# EAGLE design irisc (EAGLE 9.2.2)

## Sheet 1 of 6
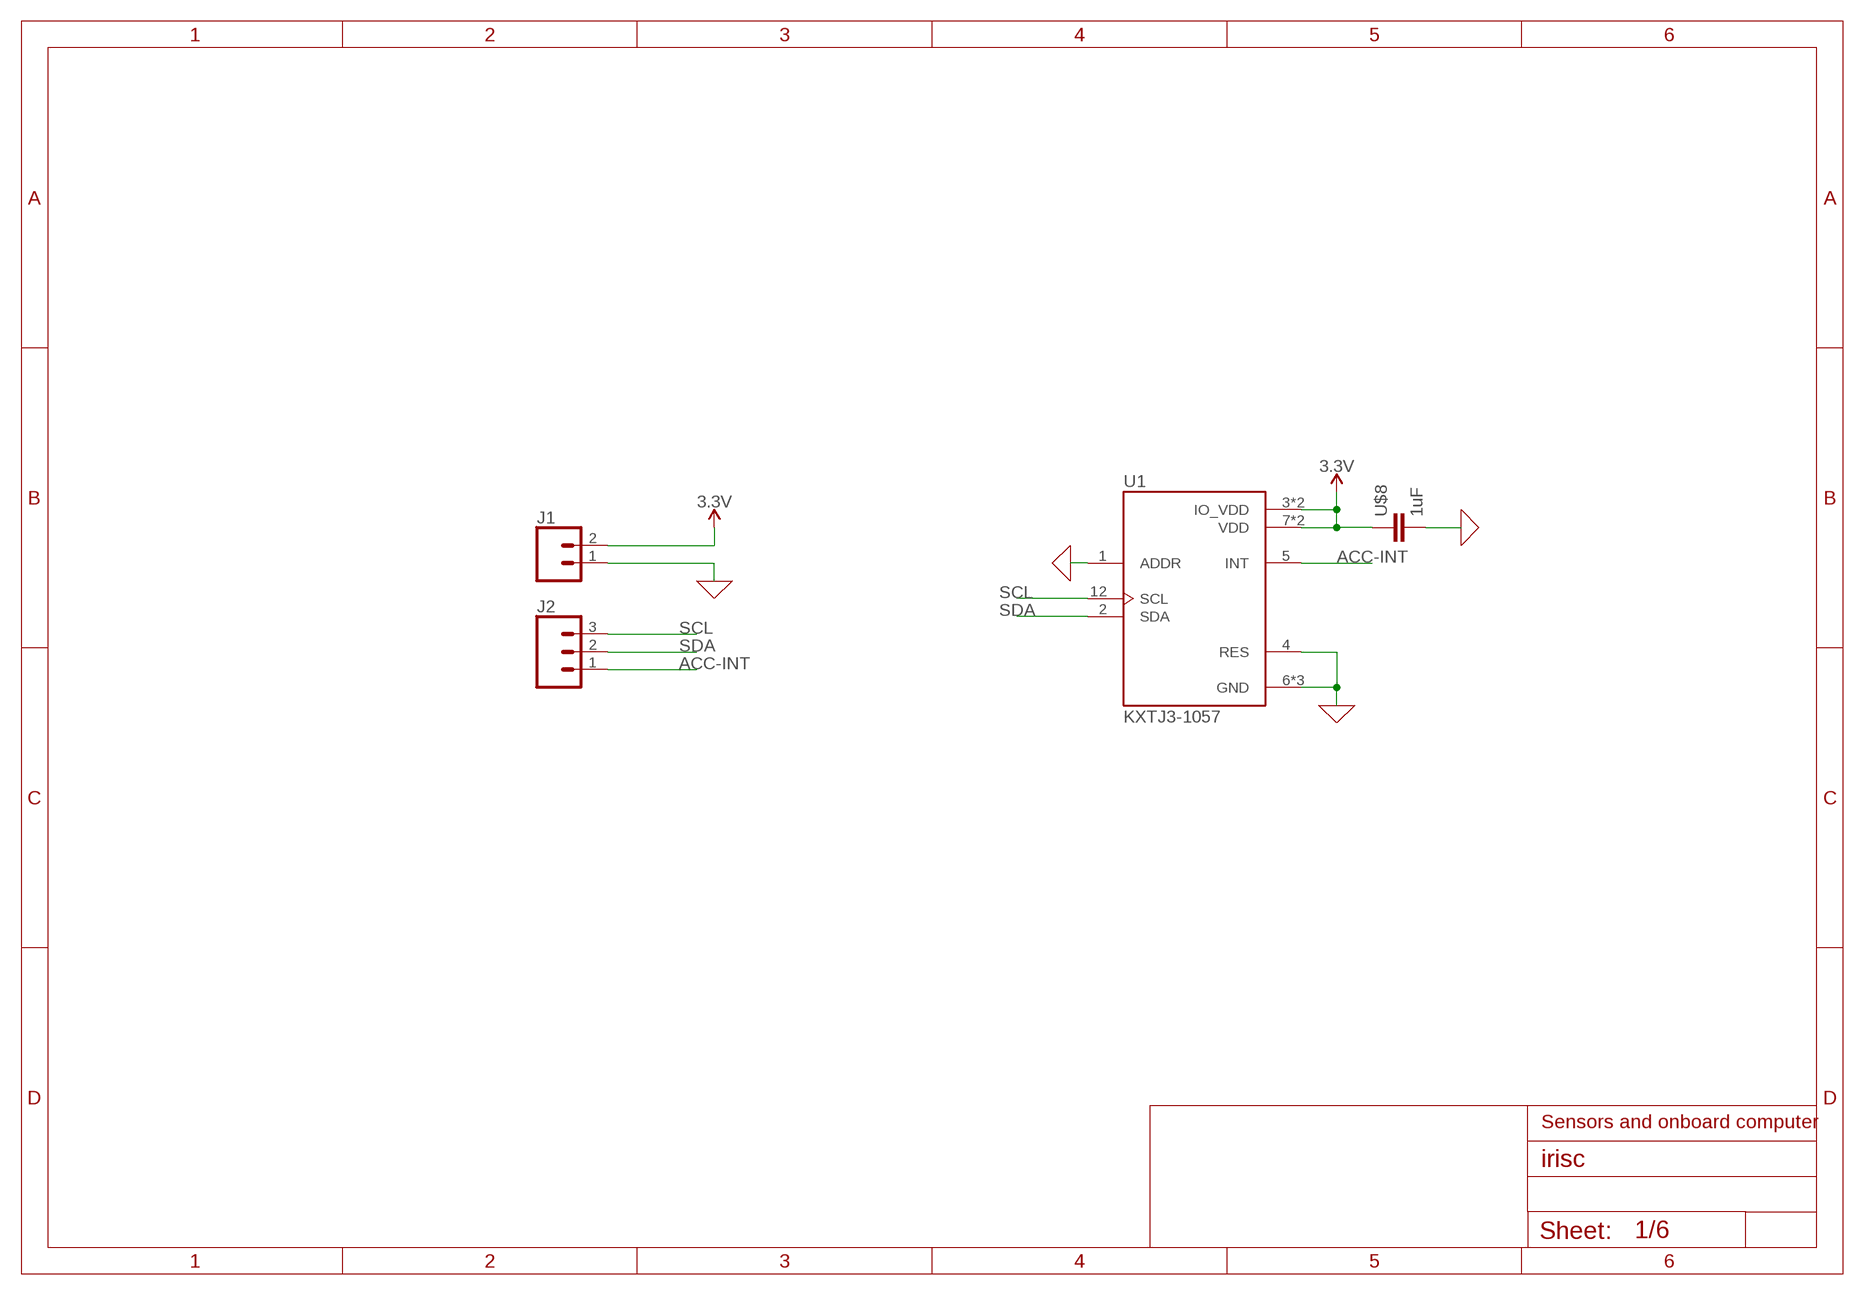
[diagram p0: schematic, sheet 1]

### Parts
J1  CONN_02  [1X02]
J2  CONN_03  [1X03]
U1  KXTJ3-1057  [KIONIX_KXTJ3-1057]
U$8  1uF  CAPACITOR_0603_N  [RESC0603_N]

### Nets
0: J1.1 U1.1(ADDR) U1.4(RES) U1.6(GND) U1.8(GND) U1.9(GND) U$8.2 ; supply symbol labelled GND ; also sheet 2,3,4,5,6
3.3V: J1.2 U1.3(IO_VDD) U1.7(VDD) U1.10(VDD) U1.11(IO_VDD) U$8.1 ; also sheet 2,3,5
ACC-INT: J2.1 U1.5(INT)
SCL: J2.3 U1.12(SCL) ; also sheet 2,5,6
SDA: J2.2 U1.2(SDA) ; also sheet 2,5,6

### Notes on the sheet
- Sensors and onboard computer

## Sheet 2 of 6
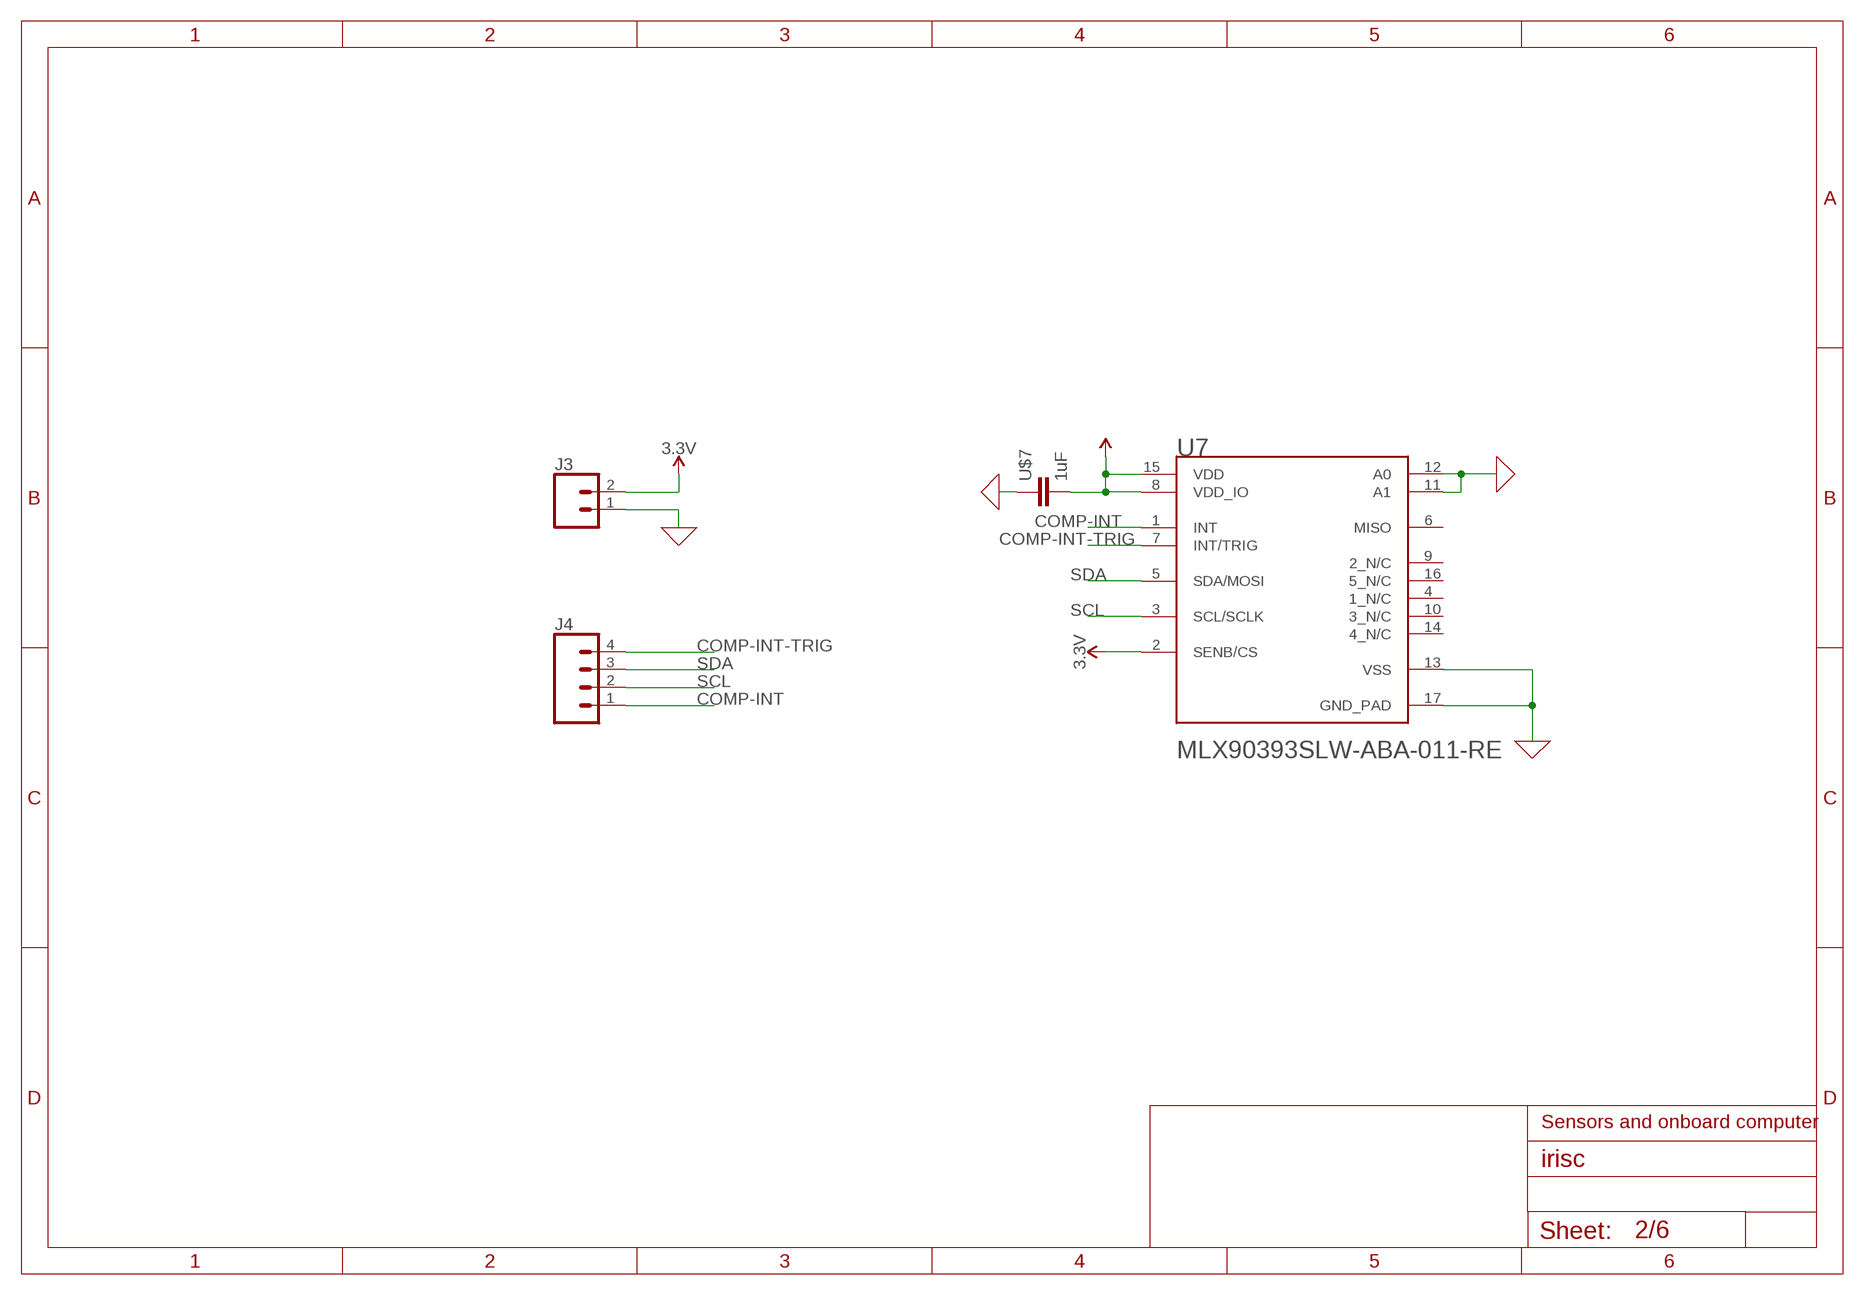
[diagram p1: schematic, sheet 2]

### Parts
J3  CONN_02  [1X02]
J4  CONN_04  [1X04]
U7  MELEXIS_TECHNOLOGIES_MLX90393SLW-ABA-011-REMELEXIS_TECHNOLOGIES_MLX90393SLW-ABA-011-RE_0_0  [MELEXIS_TECHNOLOGIES_MLX90393SLW-ABA-011-RE_0]
U$7  1uF  CAPACITOR_0603_N  [RESC0603_N]

### Nets
0: J3.1 U7.11(A1) U7.12(A0) U7.13(VSS) U7.17(GND_PAD) U$7.1 ; supply symbol labelled GND ; also sheet 1,3,4,5,6
3.3V: J3.2 U7.2(SENB/CS) U7.8(VDD_IO) U7.15(VDD) U$7.2 ; also sheet 1,3,5
COMP-INT: J4.1 U7.1(INT)
COMP-INT-TRIG: J4.4 U7.7(INT/TRIG)
SCL: J4.2 U7.3(SCL/SCLK) ; also sheet 1,5,6
SDA: J4.3 U7.5(SDA/MOSI) ; also sheet 1,5,6
Unconnected: U7.4(1_N/C) U7.6(MISO) U7.9(2_N/C) U7.10(3_N/C) U7.14(4_N/C) U7.16(5_N/C)

### Notes on the sheet
- Sensors and onboard computer

## Sheet 3 of 6
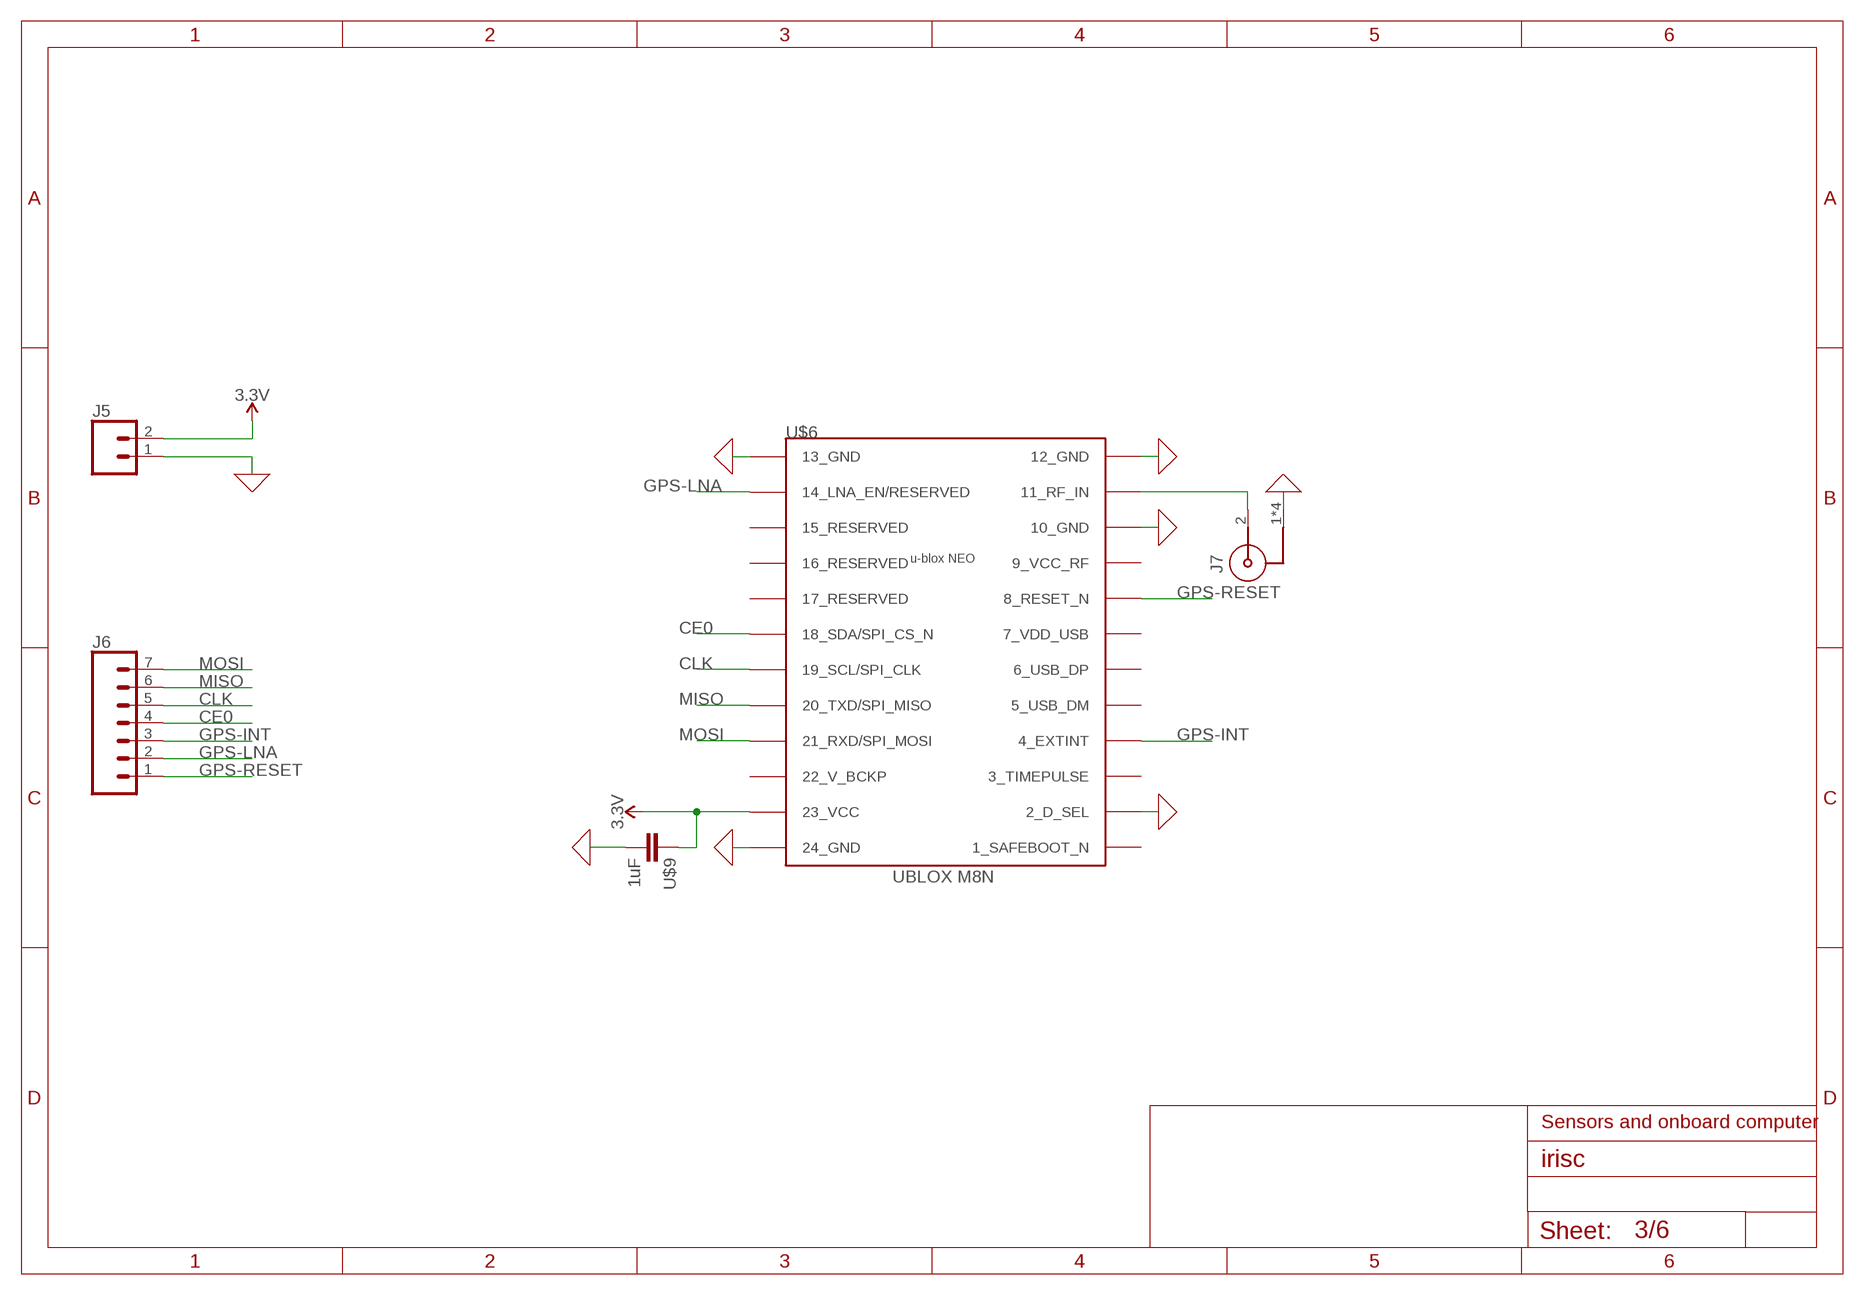
[diagram p2: schematic, sheet 3]

### Parts
J5  CONN_02  [1X02]
J6  CONN_07  [1X07]
J7  60312202114508  [60312202114508]
U$6  NEO-M8  [NEO-M8]
U$9  1uF  CAPACITOR_0603_N  [RESC0603_N]

### Nets
0: J5.1 J7.1 J7.3 J7.4 J7.5 U$6.2(2_D_SEL) U$6.10(10_GND) U$6.12(12_GND) U$6.13(13_GND) U$6.24(24_GND) U$9.2 ; supply symbol labelled GND ; also sheet 1,2,4,5,6
3.3V: J5.2 U$6.23(23_VCC) U$9.1 ; also sheet 1,2,5
CE0: J6.4 U$6.18(18_SDA/SPI_CS_N)
CLK: J6.5 U$6.19(19_SCL/SPI_CLK) ; also sheet 4
GPS-INT: J6.3 U$6.4(4_EXTINT)
GPS-LNA: J6.2 U$6.14(14_LNA_EN/RESERVED)
GPS-RESET: J6.1 U$6.8(8_RESET_N)
MISO: J6.6 U$6.20(20_TXD/SPI_MISO) ; also sheet 4
MOSI: J6.7 U$6.21(21_RXD/SPI_MOSI) ; also sheet 4
N$39: J7.2 U$6.11(11_RF_IN)
Unconnected: U$6.1(1_SAFEBOOT_N) U$6.3(3_TIMEPULSE) U$6.5(5_USB_DM) U$6.6(6_USB_DP) U$6.7(7_VDD_USB) U$6.9(9_VCC_RF) U$6.15(15_RESERVED) U$6.16(16_RESERVED) U$6.17(17_RESERVED) U$6.22(22_V_BCKP)

### Notes on the sheet
- Sensors and onboard computer

## Sheet 4 of 6
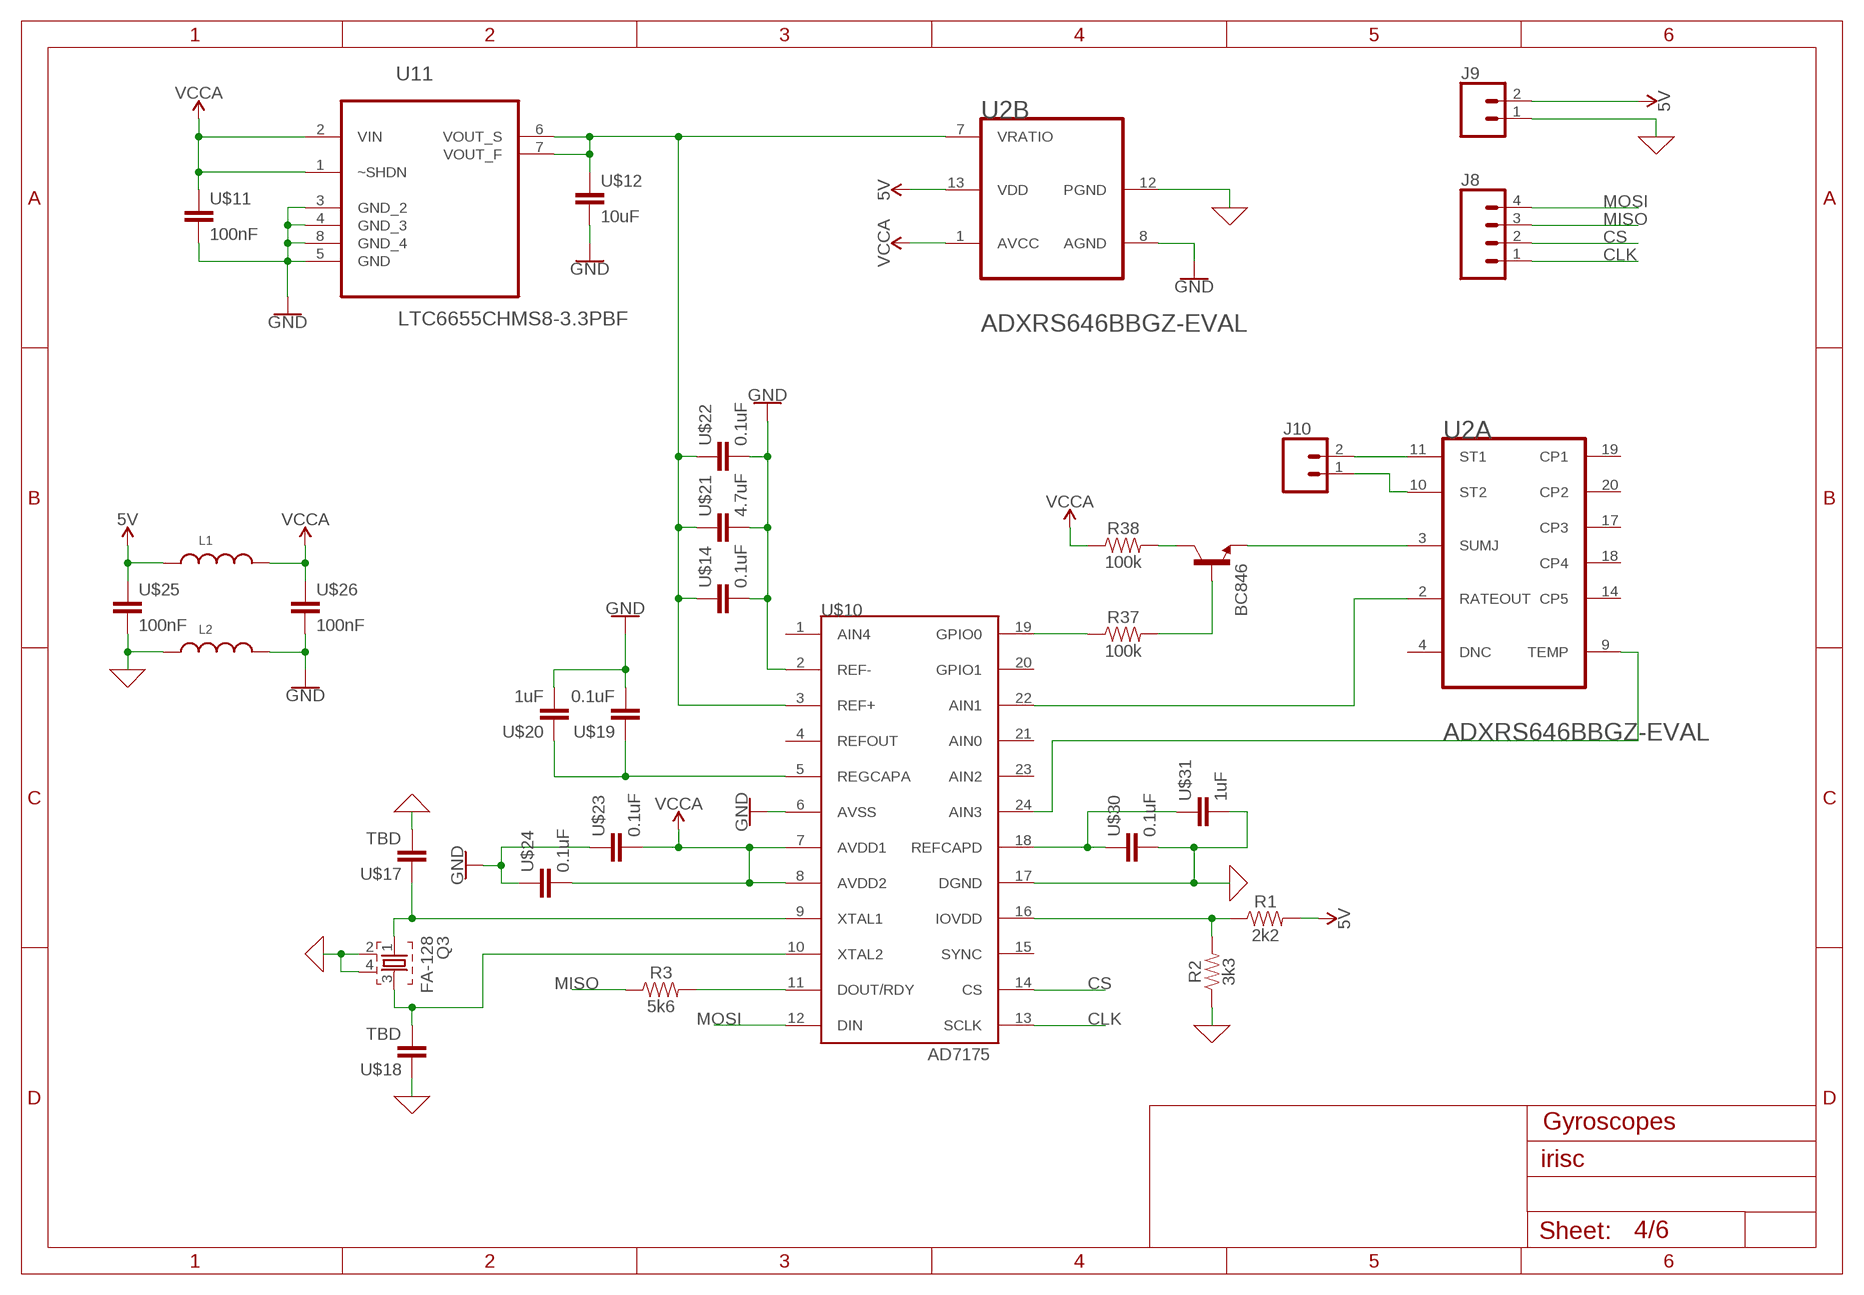
[diagram p3: schematic, sheet 4]

### Parts
J8  CONN_04  [1X04]
J9  CONN_02  [1X02]
J10  CONN_02  [1X02]
L1  WE-CBA_0805_782853152_HC  [WE-CBA_0805(W=4)]
L2  WE-CBA_0805_782853152_HC  [WE-CBA_0805(W=4)]
Q3  FA-128  [FA-128]
R1  2k2  100KOHM-HORIZ_KIT-1/4W-1%  [AXIAL-0.3-KIT]
R2  3k3  100KOHM-HORIZ_KIT-1/4W-1%  [AXIAL-0.3-KIT]
R3  5k6  100KOHM-HORIZ_KIT-1/4W-1%  [AXIAL-0.3-KIT]
R37  100k  100KOHM-HORIZ_KIT-1/4W-1%  [AXIAL-0.3-KIT]
R38  100k  100KOHM-HORIZ_KIT-1/4W-1%  [AXIAL-0.3-KIT]
T1  BC846  [SOT23]
U2  ANALOG_DEVICES_ADXRS646BBGZEVAL  [HDRVR20W64P762X254_2X10_2540X1016X254B]
U11  LTC6655CHMS8-3.3PBF  [SOP65P490X110-8N]
U$10  AD7175  [TSSOP24]
U$11  100nF  CAPACITOR_0603_N  [RESC0603_N]
U$12  10uF  CAPACITOR_0805_L  [RESC0805_L]
U$14  0.1uF  CAPACITOR_0603_N  [RESC0603_N]
U$17  TBD  CAPACITOR_0805_L  [RESC0805_L]
U$18  TBD  CAPACITOR_0805_L  [RESC0805_L]
U$19  0.1uF  CAPACITOR_0603_N  [RESC0603_N]
U$20  1uF  CAPACITOR_0603_N  [RESC0603_N]
U$21  4.7uF  CAPACITOR_0603_N  [RESC0603_N]
U$22  0.1uF  CAPACITOR_0603_N  [RESC0603_N]
U$23  0.1uF  CAPACITOR_0603_N  [RESC0603_N]
U$24  0.1uF  CAPACITOR_0603_N  [RESC0603_N]
U$25  100nF  CAPACITOR_0603_N  [RESC0603_N]
U$26  100nF  CAPACITOR_0603_N  [RESC0603_N]
U$30  0.1uF  CAPACITOR_0603_N  [RESC0603_N]
U$31  1uF  CAPACITOR_0603_N  [RESC0603_N]

### Nets
0: J9.1 L2.1 Q3.2 Q3.4 R2.P$1 U2.12(B:PGND) U$10.17(DGND) U$17.2 U$18.1 U$25.2 U$30.2 U$31.2 ; supply symbol labelled GND ; also sheet 1,2,3,5,6
5V: J9.2 L1.1 R1.P$2 U2.13(B:VDD) U$25.1 ; also sheet 6
CLK: J8.1 U$10.13(SCLK) ; also sheet 3
CS: J8.2 U$10.14(CS)
GND: L2.2 U2.8(B:AGND) U11.3(GND_2) U11.4(GND_3) U11.5(GND) U11.8(GND_4) U$10.2(REF-) U$10.6(AVSS) U$11.2 U$12.2 U$14.2 U$19.2 U$20.2 U$21.2 U$22.2 U$23.1 U$24.1 U$26.2
MISO: J8.3 R3.P$1 ; also sheet 3
MOSI: J8.4 U$10.12(DIN) ; also sheet 3
N$1: J10.1 U2.10(A:ST2)
N$2: Q3.3 U$10.10(XTAL2) U$18.2
N$40: Q3.1 U$10.9(XTAL1) U$17.1
N$42: J10.2 U2.11(A:ST1)
N$43: R38.P$2 T1.3(C)
N$45: U$10.5(REGCAPA) U$19.1 U$20.1
N$46: R37.P$2 T1.1(B)
N$48: U2.7(B:VRATIO) U11.6(VOUT_S) U11.7(VOUT_F) U$10.3(REF+) U$12.1 U$14.1 U$21.1 U$22.1
N$50: R1.P$1 R2.P$2 U$10.16(IOVDD)
N$51: U$10.18(REFCAPD) U$30.1 U$31.1
N$53: T1.2(E) U2.3(A:SUMJ)
N$58: U2.2(A:RATEOUT) U$10.22(AIN1)
N$59: U2.9(A:TEMP) U$10.24(AIN3)
N$66: R37.P$1 U$10.19(GPIO0)
SDF: R3.P$2 U$10.11(DOUT/RDY)
VCCA: L1.2 R38.P$1 U2.1(B:AVCC) U11.1(~SHDN) U11.2(VIN) U$10.7(AVDD1) U$10.8(AVDD2) U$11.1 U$23.2 U$24.2 U$26.1
Unconnected: U2.4(A:DNC) U2.17(A:CP3) U2.18(A:CP4) U2.19(A:CP1) U2.20(A:CP2) U$10.1(AIN4) U$10.4(REFOUT) U$10.15(SYNC) U$10.20(GPIO1) U$10.21(AIN0) U$10.23(AIN2)

### Notes on the sheet
- Gyroscopes

## Sheet 5 of 6
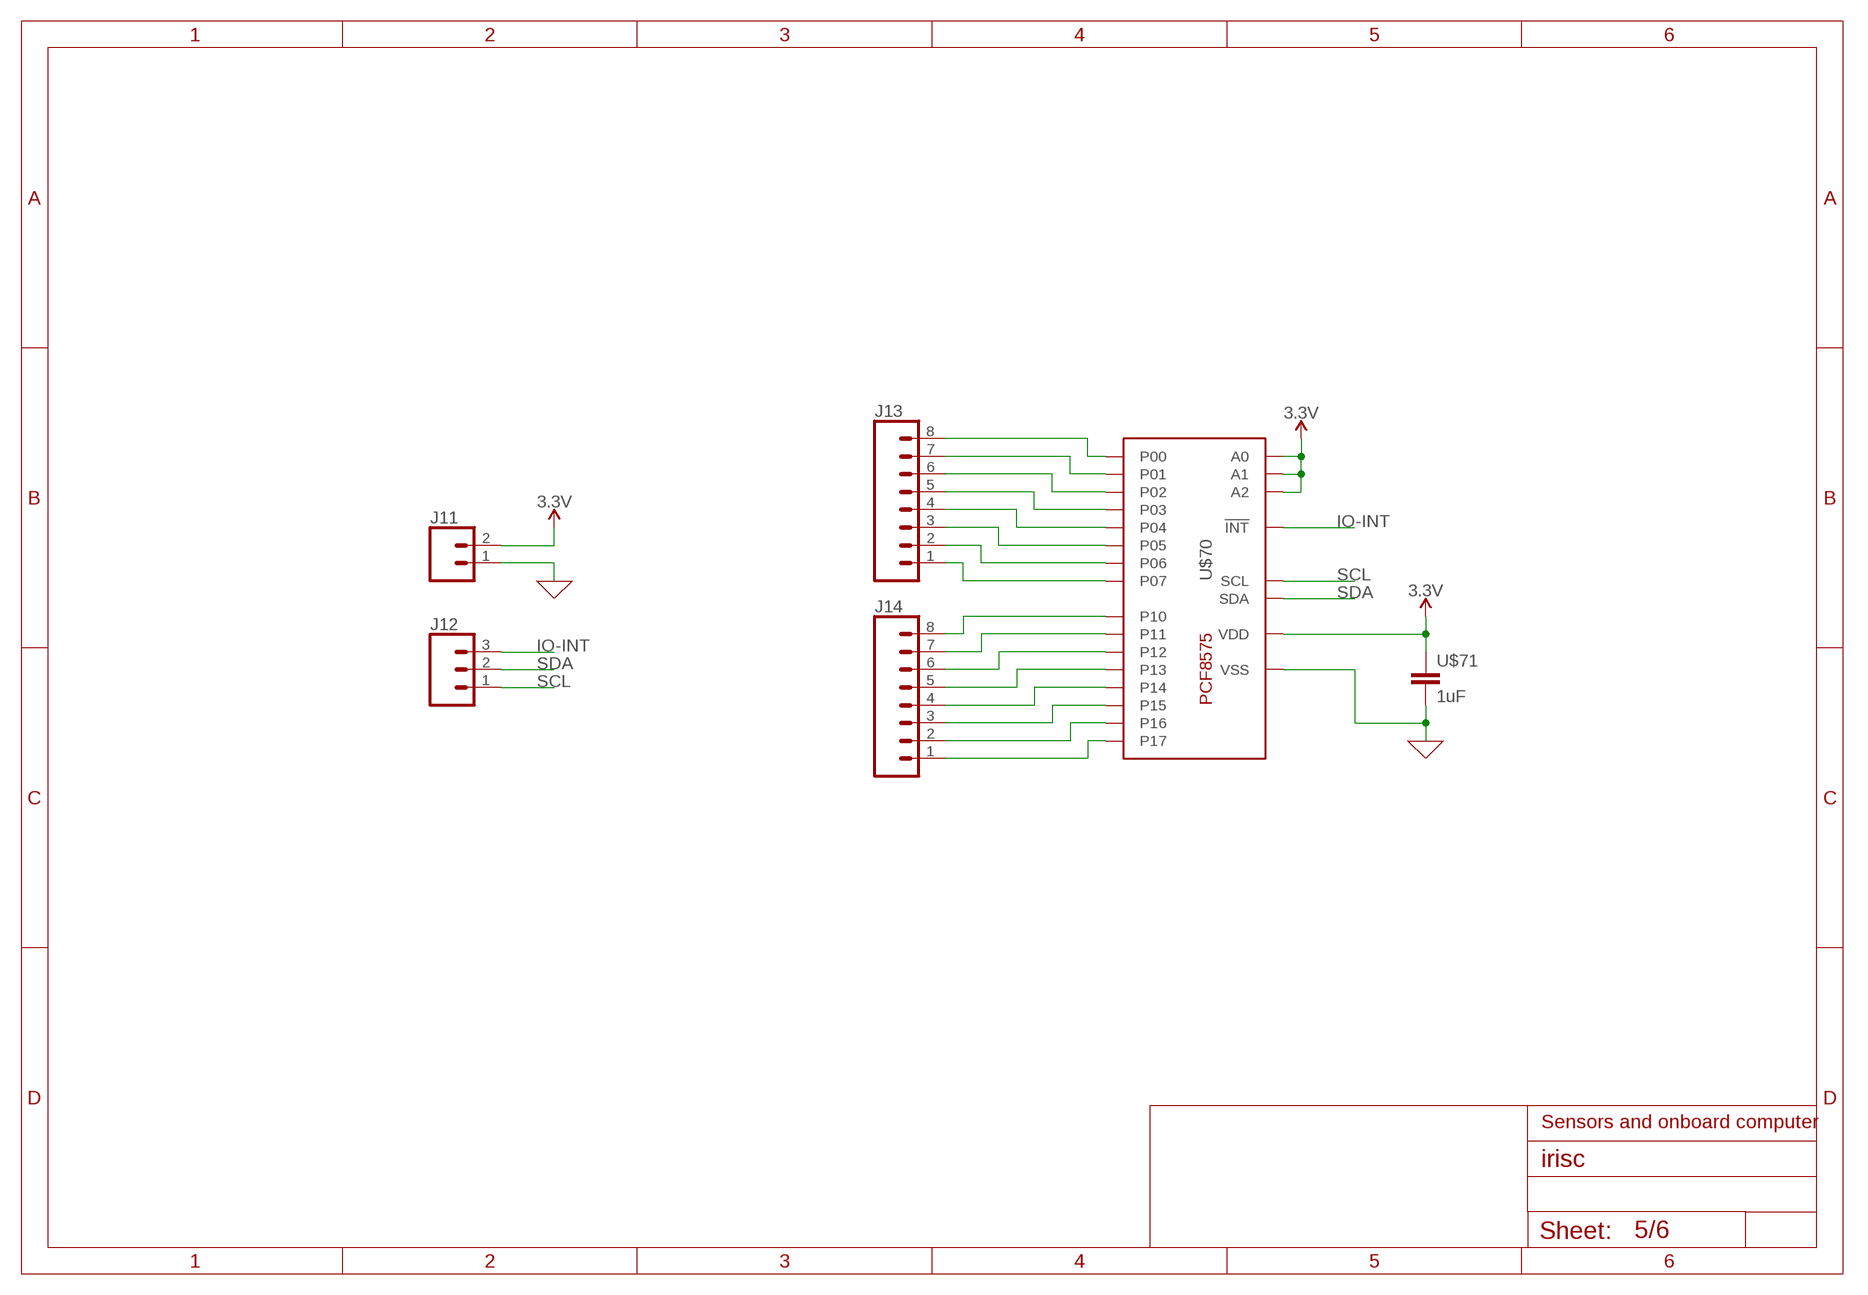
[diagram p4: schematic, sheet 5]

### Parts
J11  CONN_02  [1X02]
J12  CONN_03  [1X03]
J13  CONN_08"  [1X08]
J14  CONN_08"  [1X08]
U$70  PCF8575CSSOP24N  [SOP65P810X120-24]
U$71  1uF  CAPACITOR_0603_N  [RESC0603_N]

### Nets
0: J11.1 U$70.12(VSS) U$71.2 ; supply symbol labelled GND ; also sheet 1,2,3,4,6
3.3V: J11.2 U$70.2(A1) U$70.3(A2) U$70.21(A0) U$70.24(VDD) U$71.1 ; also sheet 1,2,3
IO-INT: J12.3 U$70.1(!INT)
N$3: J13.8 U$70.4(P00)
N$4: J13.7 U$70.5(P01)
N$5: J13.6 U$70.6(P02)
N$6: J13.5 U$70.7(P03)
N$7: J13.4 U$70.8(P04)
N$8: J13.3 U$70.9(P05)
N$9: J13.2 U$70.10(P06)
N$10: J13.1 U$70.11(P07)
N$11: J14.8 U$70.13(P10)
N$12: J14.7 U$70.14(P11)
N$13: J14.6 U$70.15(P12)
N$14: J14.5 U$70.16(P13)
N$15: J14.4 U$70.17(P14)
N$16: J14.3 U$70.18(P15)
N$17: J14.2 U$70.19(P16)
N$18: J14.1 U$70.20(P17)
SCL: J12.1 U$70.22(SCL) ; also sheet 1,2,6
SDA: J12.2 U$70.23(SDA) ; also sheet 1,2,6

### Notes on the sheet
- Sensors and onboard computer

## Sheet 6 of 6
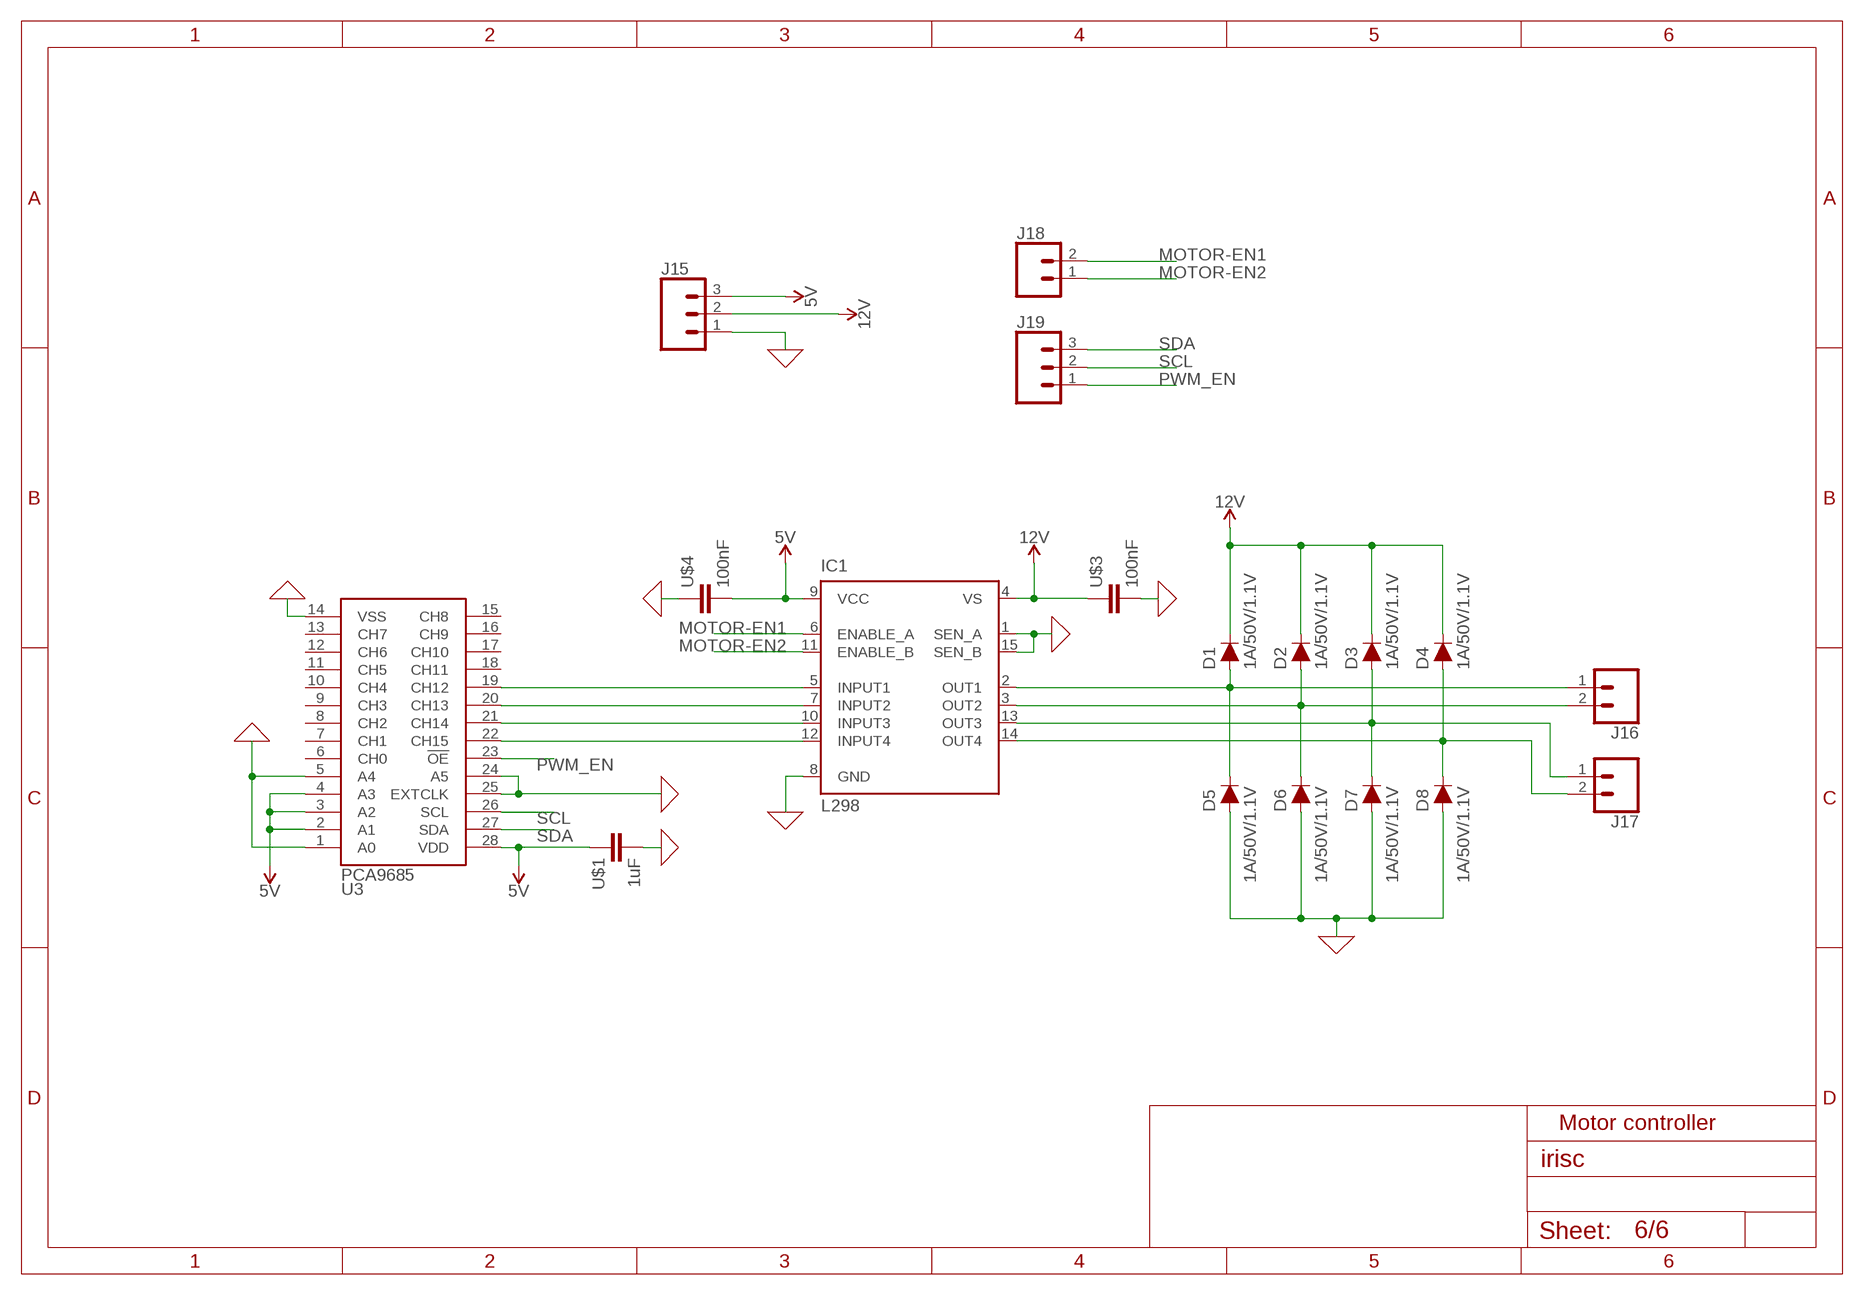
[diagram p5: schematic, sheet 6]

### Parts
D1  1A/50V/1.1V  DIODE-PTH  [DIODE-1N4001]
D2  1A/50V/1.1V  DIODE-PTH  [DIODE-1N4001]
D3  1A/50V/1.1V  DIODE-PTH  [DIODE-1N4001]
D4  1A/50V/1.1V  DIODE-PTH  [DIODE-1N4001]
D5  1A/50V/1.1V  DIODE-PTH  [DIODE-1N4001]
D6  1A/50V/1.1V  DIODE-PTH  [DIODE-1N4001]
D7  1A/50V/1.1V  DIODE-PTH  [DIODE-1N4001]
D8  1A/50V/1.1V  DIODE-PTH  [DIODE-1N4001]
IC1  L298  [MULTIWATT-15]
J15  CONN_03  [1X03]
J16  CONN_023.5MM  [SCREWTERMINAL-3.5MM-2]
J17  CONN_023.5MM  [SCREWTERMINAL-3.5MM-2]
J18  CONN_02  [1X02]
J19  CONN_03  [1X03]
U3  PCA9685  [TSSOP-28_4MM]
U$1  1uF  CAPACITOR_0805_L  [RESC0805_L]
U$3  100nF  CAPACITOR_0603_L  [RESC0603_L]
U$4  100nF  CAPACITOR_0603_L  [RESC0603_L]

### Nets
0: D5.A D6.A D7.A D8.A IC1.1(SEN_A) IC1.8(GND) IC1.15(SEN_B) J15.1 U3.1(A0) U3.5(A4) U3.14(VSS) U3.24(A5) U3.25(EXTCLK) U$1.2 U$3.2 U$4.1 ; supply symbol labelled GND ; also sheet 1,2,3,4,5
5V: IC1.9(VCC) J15.3 U3.2(A1) U3.3(A2) U3.4(A3) U3.28(VDD) U$1.1 U$4.2 ; also sheet 4
12V: D1.C D2.C D3.C D4.C IC1.4(VS) J15.2 U$3.1
MOTOR-EN1: IC1.6(ENABLE_A) J18.2
MOTOR-EN2: IC1.11(ENABLE_B) J18.1
N$19: IC1.5(INPUT1) U3.19(CH12)
N$20: IC1.7(INPUT2) U3.20(CH13)
N$21: IC1.10(INPUT3) U3.21(CH14)
N$22: IC1.12(INPUT4) U3.22(CH15)
N$31: D1.A D5.C IC1.2(OUT1) J16.1
N$32: D2.A D6.C IC1.3(OUT2) J16.2
N$33: D3.A D7.C IC1.13(OUT3) J17.1
N$34: D4.A D8.C IC1.14(OUT4) J17.2
PWM_EN: J19.1 U3.23(!OE)
SCL: J19.2 U3.26(SCL) ; also sheet 1,2,5
SDA: J19.3 U3.27(SDA) ; also sheet 1,2,5
Unconnected: U3.6(CH0) U3.7(CH1) U3.8(CH2) U3.9(CH3) U3.10(CH4) U3.11(CH5) U3.12(CH6) U3.13(CH7) U3.15(CH8) U3.16(CH9) U3.17(CH10) U3.18(CH11)

### Notes on the sheet
- Motor controller

## Power pins joined to a net without a drawn wire
CP5: U2.14(A:CP5)

## Library data of the parts
D1-D8 = SparkFun-DiscreteSemi:DIODE: Diode These are standard reverse protection diodes and small signal diodes. SparkFun Products: SparkFun SparkPunk Sound Kit <https://www.sparkfun.com/products/11177> SparkFun ESP8266 Thing <https://www.sparkfun.com/products/13231>; PROD_ID: DIO-09176
IC1 = st-microelectronics:L298: DUAL FULL-BRIDGE DRIVER; MPN: L298N; OC_FARNELL: 1589425; OC_NEWARK: 32M1527; SPICEPREFIX: X
J1 J3 J5 J9-J11 J18 = SparkFun-Connectors:CONN_02: Multi connection point. Often used as Generic Header-pin footprint for 0.1 inch spaced/style header connections On any of the 0.1 inch spaced packages, you can populate with these: Break Away Headers - Straight <https://www.sparkfun.com/products/116> (PRT-00116) Break Away Male Headers - Right Angle <https://www.sparkfun.com/products/553> (PRT-00553) Female Headers <https://www.sparkfun.com/products/115> (PRT-00115) Break Away Headers - Machine Pin <https://www.sparkfun.com/products/117> (PRT-00117) Break Away Female Headers - Swiss Machine Pin <https://www.sparkfun.com/products/743> (PRT-00743) For SCREWTERMINALS and SPRING TERMINALS visit here: Screw Terimnals on SparkFun.com <https://www.sparkfun.com/search/results?term=Screw+Terminals> (5mm/3.5mm/2.54mm spacing) This device is also useful as a general connection point to wire up your design to another part of your project. Our various solder wires solder well into these plated through hole pads. Hook-Up Wire - Assortment (Stranded, 22 AWG) <https://www.sparkfun.com/products/11375> (PRT-11375) Hook-Up Wire - Assortment (Solid Core, 22 AWG) <https://www.sparkfun.com/products/11367> (PRT-11367) View the entire wire category on our website here <https://www.sparkfun.com/categories/141> Special notes: Molex polarized connector foot print use with: PRT-08233 with associated crimp pins and housings. 2.54_SCREWTERM for use with PRT-10571. 3.5mm Screw Terminal footprints for PRT-08084 5mm Screw Terminal footprints for use with PRT-08432
J2 J12 J15 J19 = SparkFun-Connectors:CONN_03: Multi connection point. Often used as Generic Header-pin footprint for 0.1 inch spaced/style header connections On any of the 0.1 inch spaced packages, you can populate with these: Break Away Headers - Straight <https://www.sparkfun.com/products/116> (PRT-00116) Break Away Male Headers - Right Angle <https://www.sparkfun.com/products/553> (PRT-00553) Female Headers <https://www.sparkfun.com/products/115> (PRT-00115) Break Away Headers - Machine Pin <https://www.sparkfun.com/products/117> (PRT-00117) Break Away Female Headers - Swiss Machine Pin <https://www.sparkfun.com/products/743> (PRT-00743) Stackable Header - 3 Pin (Female, 0.1") <https://www.sparkfun.com/products/13875> (PRT-13875) For SCREWTERMINALS and SPRING TERMINALS visit here: Screw Terimnals on SparkFun.com <https://www.sparkfun.com/search/results?term=Screw+Terminals> (5mm/3.5mm/2.54mm spacing) This device is also useful as a general connection point to wire up your design to another part of your project. Our various solder wires solder well into these plated through hole pads. Hook-Up Wire - Assortment (Stranded, 22 AWG) <https://www.sparkfun.com/products/11375> (PRT-11375) Hook-Up Wire - Assortment (Solid Core, 22 AWG) <https://www.sparkfun.com/products/11367> (PRT-11367) View the entire wire category on our website here <https://www.sparkfun.com/categories/141> Special notes: Molex polarized connector foot print use with SKU : PRT-08232 with associated crimp pins and housings.
J4 J8 = SparkFun-Connectors:CONN_04: Multi connection point. Often used as Generic Header-pin footprint for 0.1 inch spaced/style header connections On any of the 0.1 inch spaced packages, you can populate with these: Break Away Headers - Straight <https://www.sparkfun.com/products/116> (PRT-00116) Break Away Male Headers - Right Angle <https://www.sparkfun.com/products/553> (PRT-00553) Female Headers <https://www.sparkfun.com/products/115> (PRT-00115) Break Away Headers - Machine Pin <https://www.sparkfun.com/products/117> (PRT-00117) Break Away Female Headers - Swiss Machine Pin <https://www.sparkfun.com/products/743> (PRT-00743) For SCREWTERMINALS and SPRING TERMINALS visit here: Screw Terimnals on SparkFun.com <https://www.sparkfun.com/search/results?term=Screw+Terminals> (5mm/3.5mm/2.54mm spacing) This device is also useful as a general connection point to wire up your design to another part of your project. Our various solder wires solder well into these plated through hole pads. Hook-Up Wire - Assortment (Stranded, 22 AWG) <https://www.sparkfun.com/products/11375> (PRT-11375) Hook-Up Wire - Assortment (Solid Core, 22 AWG) <https://www.sparkfun.com/products/11367> (PRT-11367) View the entire wire category on our website here <https://www.sparkfun.com/categories/141> Special notes: Molex polarized connector foot print use with SKU : PRT-08231 with associated crimp pins and housings. 1MM SMD Version SKU: PRT-10208; PROD_ID: CONN-09696
J6 = SparkFun-Connectors:CONN_07: Multi connection point. Often used as Generic Header-pin footprint for 0.1 inch spaced/style header connections On any of the 0.1 inch spaced packages, you can populate with these: Break Away Headers - Straight <https://www.sparkfun.com/products/116> (PRT-00116) Break Away Male Headers - Right Angle <https://www.sparkfun.com/products/553> (PRT-00553) Female Headers <https://www.sparkfun.com/products/115> (PRT-00115) Break Away Headers - Machine Pin <https://www.sparkfun.com/products/117> (PRT-00117) Break Away Female Headers - Swiss Machine Pin <https://www.sparkfun.com/products/743> (PRT-00743) For SCREWTERMINALS and SPRING TERMINALS visit here: Screw Terimnals on SparkFun.com <https://www.sparkfun.com/search/results?term=Screw+Terminals> (5mm/3.5mm/2.54mm spacing) This device is also useful as a general connection point to wire up your design to another part of your project. Our various solder wires solder well into these plated through hole pads. Hook-Up Wire - Assortment (Stranded, 22 AWG) <https://www.sparkfun.com/products/11375> (PRT-11375) Hook-Up Wire - Assortment (Solid Core, 22 AWG) <https://www.sparkfun.com/products/11367> (PRT-11367) View the entire wire category on our website here <https://www.sparkfun.com/categories/141> Special notes: Molex polarized connector foot print use with SKU : PRT-08231 with associated crimp pins and housings. 1MM SMD Version SKU: PRT-10208 NOTES ON THE VARIANTS LOCK and LOCK_LONGPADS... This footprint was designed to help hold the alignment of a through-hole component (i.e. 6-pin header) while soldering it into place. You may notice that each hole has been shifted either up or down by 0.005 of an inch from it's more standard position (which is a perfectly straight line). This slight alteration caused the pins (the squares in the middle) to touch the edges of the holes. Because they are alternating, it causes a "brace" to hold the component in place. 0.005 has proven to be the perfect amount of "off-center" position when using our standard breakaway headers. Although looks a little odd when you look at the bare footprint, once you have a header in there, the alteration is very hard to notice. Also,if you push a header all the way into place, it is covered up entirely on the bottom side.
J7 = Wurth_Elektronik_Electromechanic_Coaxial _Connectors_rev18a:60312202114508: SMA PCB End Launch Jack Round Post for 1.1mm PCB WR-SMA ARTICLE PROPERTIES: PCB Thickness 1.1 mm MATERIAL PROPERTIES: Insulator Material PTFE Insulator Color White Center Contact Material Beryllium Copper Center Contact Plating Gold, min. 0.76µm over Nickel Body Material Brass Body Plating Gold, min. 0.076µm over Nickel KIND PROPERTIES: Interface MIL-STD-348 Connector Type SMA Gender Jack Orientation Type Straight GENERAL INFORMATION: Operating Temperature -65 °C up to +165 °C Compliance RoHS ELECTRICAL PROPERTIES: Impedance 50 Ω Frequency Range DC~18 GHz MECHANICAL PROPERTIES: Center Contact Retention (Axial) 26.7 N Mating Cycle 500 Cycles Recommended Mating Torque 57 Ncm PACKAGING PROPERTIES: Packaging Tray <http://katalog.we-online.de/media/images/v2/WR-SMA_60312202114508.jpg> Details see: http://katalog.we-online.de/em/datasheet/60312202114508.pdf Created 2018-04-24,Yingchun,Shan 2018(C) Würth Elektronik
J13 J14 = SparkFun-Connectors:CONN_08: Multi connection point. Often used as Generic Header-pin footprint for 0.1 inch spaced/style header connections On any of the 0.1 inch spaced packages, you can populate with these: Break Away Headers - Straight <https://www.sparkfun.com/products/116> (PRT-00116) Break Away Male Headers - Right Angle <https://www.sparkfun.com/products/553> (PRT-00553) Female Headers <https://www.sparkfun.com/products/115> (PRT-00115) Break Away Headers - Machine Pin <https://www.sparkfun.com/products/117> (PRT-00117) Break Away Female Headers - Swiss Machine Pin <https://www.sparkfun.com/products/743> (PRT-00743) Arduino Stackable Header - 8 Pin <https://www.sparkfun.com/products/9279> (PRT-09279) For SCREWTERMINALS and SPRING TERMINALS visit here: Screw Terimnals on SparkFun.com <https://www.sparkfun.com/search/results?term=Screw+Terminals> (5mm/3.5mm/2.54mm spacing) This device is also useful as a general connection point to wire up your design to another part of your project. Our various solder wires solder well into these plated through hole pads. Hook-Up Wire - Assortment (Stranded, 22 AWG) <https://www.sparkfun.com/products/11375> (PRT-11375) Hook-Up Wire - Assortment (Solid Core, 22 AWG) <https://www.sparkfun.com/products/11367> (PRT-11367) View the entire wire category on our website here <https://www.sparkfun.com/categories/141> Special notes: Molex polarized connector foot print use with SKU : PRT-08231 with associated crimp pins and housings. 1MM SMD Version SKU: PRT-10208 NOTES ON THE VARIANTS LOCK and LOCK_LONGPADS... This footprint was designed to help hold the alignment of a through-hole component (i.e. 6-pin header) while soldering it into place. You may notice that each hole has been shifted either up or down by 0.005 of an inch from it's more standard position (which is a perfectly straight line). This slight alteration caused the pins (the squares in the middle) to touch the edges of the holes. Because they are alternating, it causes a "brace" to hold the component in place. 0.005 has proven to be the perfect amount of "off-center" position when using our standard breakaway headers. Although looks a little odd when you look at the bare footprint, once you have a header in there, the alteration is very hard to notice. Also,if you push a header all the way into place, it is covered up entirely on the bottom side.; PROD_ID: CONN-08438
J16 J17 = SparkFun-Connectors:CONN_02: Multi connection point. Often used as Generic Header-pin footprint for 0.1 inch spaced/style header connections On any of the 0.1 inch spaced packages, you can populate with these: Break Away Headers - Straight <https://www.sparkfun.com/products/116> (PRT-00116) Break Away Male Headers - Right Angle <https://www.sparkfun.com/products/553> (PRT-00553) Female Headers <https://www.sparkfun.com/products/115> (PRT-00115) Break Away Headers - Machine Pin <https://www.sparkfun.com/products/117> (PRT-00117) Break Away Female Headers - Swiss Machine Pin <https://www.sparkfun.com/products/743> (PRT-00743) For SCREWTERMINALS and SPRING TERMINALS visit here: Screw Terimnals on SparkFun.com <https://www.sparkfun.com/search/results?term=Screw+Terminals> (5mm/3.5mm/2.54mm spacing) This device is also useful as a general connection point to wire up your design to another part of your project. Our various solder wires solder well into these plated through hole pads. Hook-Up Wire - Assortment (Stranded, 22 AWG) <https://www.sparkfun.com/products/11375> (PRT-11375) Hook-Up Wire - Assortment (Solid Core, 22 AWG) <https://www.sparkfun.com/products/11367> (PRT-11367) View the entire wire category on our website here <https://www.sparkfun.com/categories/141> Special notes: Molex polarized connector foot print use with: PRT-08233 with associated crimp pins and housings. 2.54_SCREWTERM for use with PRT-10571. 3.5mm Screw Terminal footprints for PRT-08084 5mm Screw Terminal footprints for use with PRT-08432; PROD_ID: CONN-08399
L1 L2 = Wurth_Elektronik_Passive_rev18f:WE-CBA_0805: WE-CBA SMD EMI Suppression Ferrite Bead Characteristics Reliable Ni-Sn electrodes High rated current up to 5A Recommended soldering: Reflow Operating temperature: -55°C to +125°C Applications * Perfect as data line filter and for uncoupling of distribution voltage *This special SMD chip bead ferrites can be put directly on the printed circuit board. They offer excellent anti-EMI properties and low DC-resistance. Placed very close next to the interference source even with smallest size 0402,maximal impedance at 1000 Ω can be reached. *High Speed: "High Speed " SMD ferrites WE-CBF have lower impedance in the lower frequency ranges thus they have only a low attenuation for fast signals. Application e.g. USB 2.0, IEEE 1394,LVDS *Wide Band: "Wide Band" SMD ferrites WE-CBF already show high impedance in low frequency range. Therefore they are wide band through the whole spectrum. Application e.g. control signats, RS232, RS422, DC/DC converter *High Current: "High Current " SMD ferrites WE-CBF are designed for high current (over 1 A). The rated current refers to 40K self-heating. High current SMD ferrites are available in all there types (High Speed, Wide Band and High Frequency). Application e.g. power supply, DC/DC converter *Advice: Pay attention for the use of SMD-Ferrites for high current>1A and ambient temperature over +85°C that the rated current has to be reduced when temperature is above +85°C (Derating). *At+100°C environment temperature the maximal rated current has to add up to only 60% of the data sheet value ,without an overload of the component. Variant abbreviation WB means WIDE BAND HS means HIGH SPEED HC means HIGH CURRENT <http://katalog.we-online.de/media/images/v2/Family_WE-CBA.jpg> Details see: http://katalog.we-online.de/en/pbs/WE-CBA/ Created: 2015-02-02 2015 (C) Wurth Elektronik
Q3 = crystal:FA-: MHz RANGE CRYSTAL UNIT Source: Epson Toyocom
R1-R3 = SparkFun-Resistors:100KOHM: 100kΩ resistor A resistor is a passive two-terminal electrical component that implements electrical resistance as a circuit element. Resistors act to reduce current flow, and, at the same time, act to lower voltage levels within circuits. - Wikipedia; PROD_ID: RES-12184; VALUE: 100k
R37 R38 = SparkFun-Resistors:100KOHM: 100kΩ resistor A resistor is a passive two-terminal electrical component that implements electrical resistance as a circuit element. Resistors act to reduce current flow, and, at the same time, act to lower voltage levels within circuits. - Wikipedia; PROD_ID: RES-12184
T1 = transistor:BC846: NPN TRANSISTOR
U1 = KXTJ3-1057:KXTJ3-1057: Mems Accelerometer, 2G/4G/8G, Lga-12; AVAILABILITY: Unavailable; DESCRIPTION: Mems Accelerometer, 2G/4G/8G, Lga-12; MF: Kionix Inc.; MP: KXTJ3-1057; PACKAGE: LGA-12 Kionix; PRICE: None
U2 = Analog Devices - ADXRS646BBGZ-EVAL:ANALOG_DEVICES_ADXRS646BBGZ: ADI-ADXRS646-BG-32-3
U3 = SparkFun-IC-Special-Function:PCA9685: 16-channel 12-bit PWM I2C interface Internal Oscillator 40Hz to 1kHz Can be totem pole or open collector 2.3V to 5.5V SparkFun Products SparkFun Block for Intel® Edison - PWM <https://www.sparkfun.com/products/13042> (DEV-13042) PROTO: IC-12240 PROD_ID: IC-12271; PROD_ID: IC-12271
U7 = Melexis Technologies - MLX90393SLW-ABA-011-RE:MELEXIS_TECHNOLOGIES_MLX90393SLW-ABA-011-RE: Micropower Triaxis Magnetometer Datasheet; DATASHEET: https://www.melexis.com/-/media/files/documents/datasheets/mlx90393-datasheet-melexis.pdf; DIGIKEY_DESCRIPTION: IC Hall Effect Sensor X, Y, Z Axis 16-QFN (3x3); DIGIKEY_PART_NUMBER: MLX90393SLW-ABA-011-RECT-ND; IPC_LAND_PATTERN_NAME: QFN50P300X300X90-16; LEAD_FREE: yes; MF: Melexis Technologies; MOUSER_PART_NUMBER: 482-90393SLWABA011RE; MPN: MLX90393SLW-ABA-011-RE; PACKAGE: QFN-16; PREFIX: U; ROHS: yes; TEMPERATURE_RANGE_HIGH: +85°C; TEMPERATURE_RANGE_LOW: -20°C
U11 = LTC6655CHMS8-3.3PBF:LTC6655CHMS8-3.3PBF: 0.25ppm Noise, Low Drift Precision Buffered Reference; AVAILABILITY: Unavailable; DESCRIPTION: LTC6655 - 0.25ppm Noise, Low Drift Precision References; MF: Linear Technology/Analog; MP: LTC6655CHMS8-3.3#PBF; PACKAGE: MSOP-8 Linear Technology; PRICE: None
U$1 U$3 U$4 U$7-U$9 U$11 U$12 U$14 U$17-U$26 U$30 U$31 U$71 = Nordic_nRF:CAPACITOR: Generic chip capacitor
U$6 = ubloxLib:NEO-M8: u-blox NEO GNSS module
U$10 = Analog Devices - AD7997BRUZ-1REEL:AD7175
U$70 = pcf8575c:PCF8575C

## Board
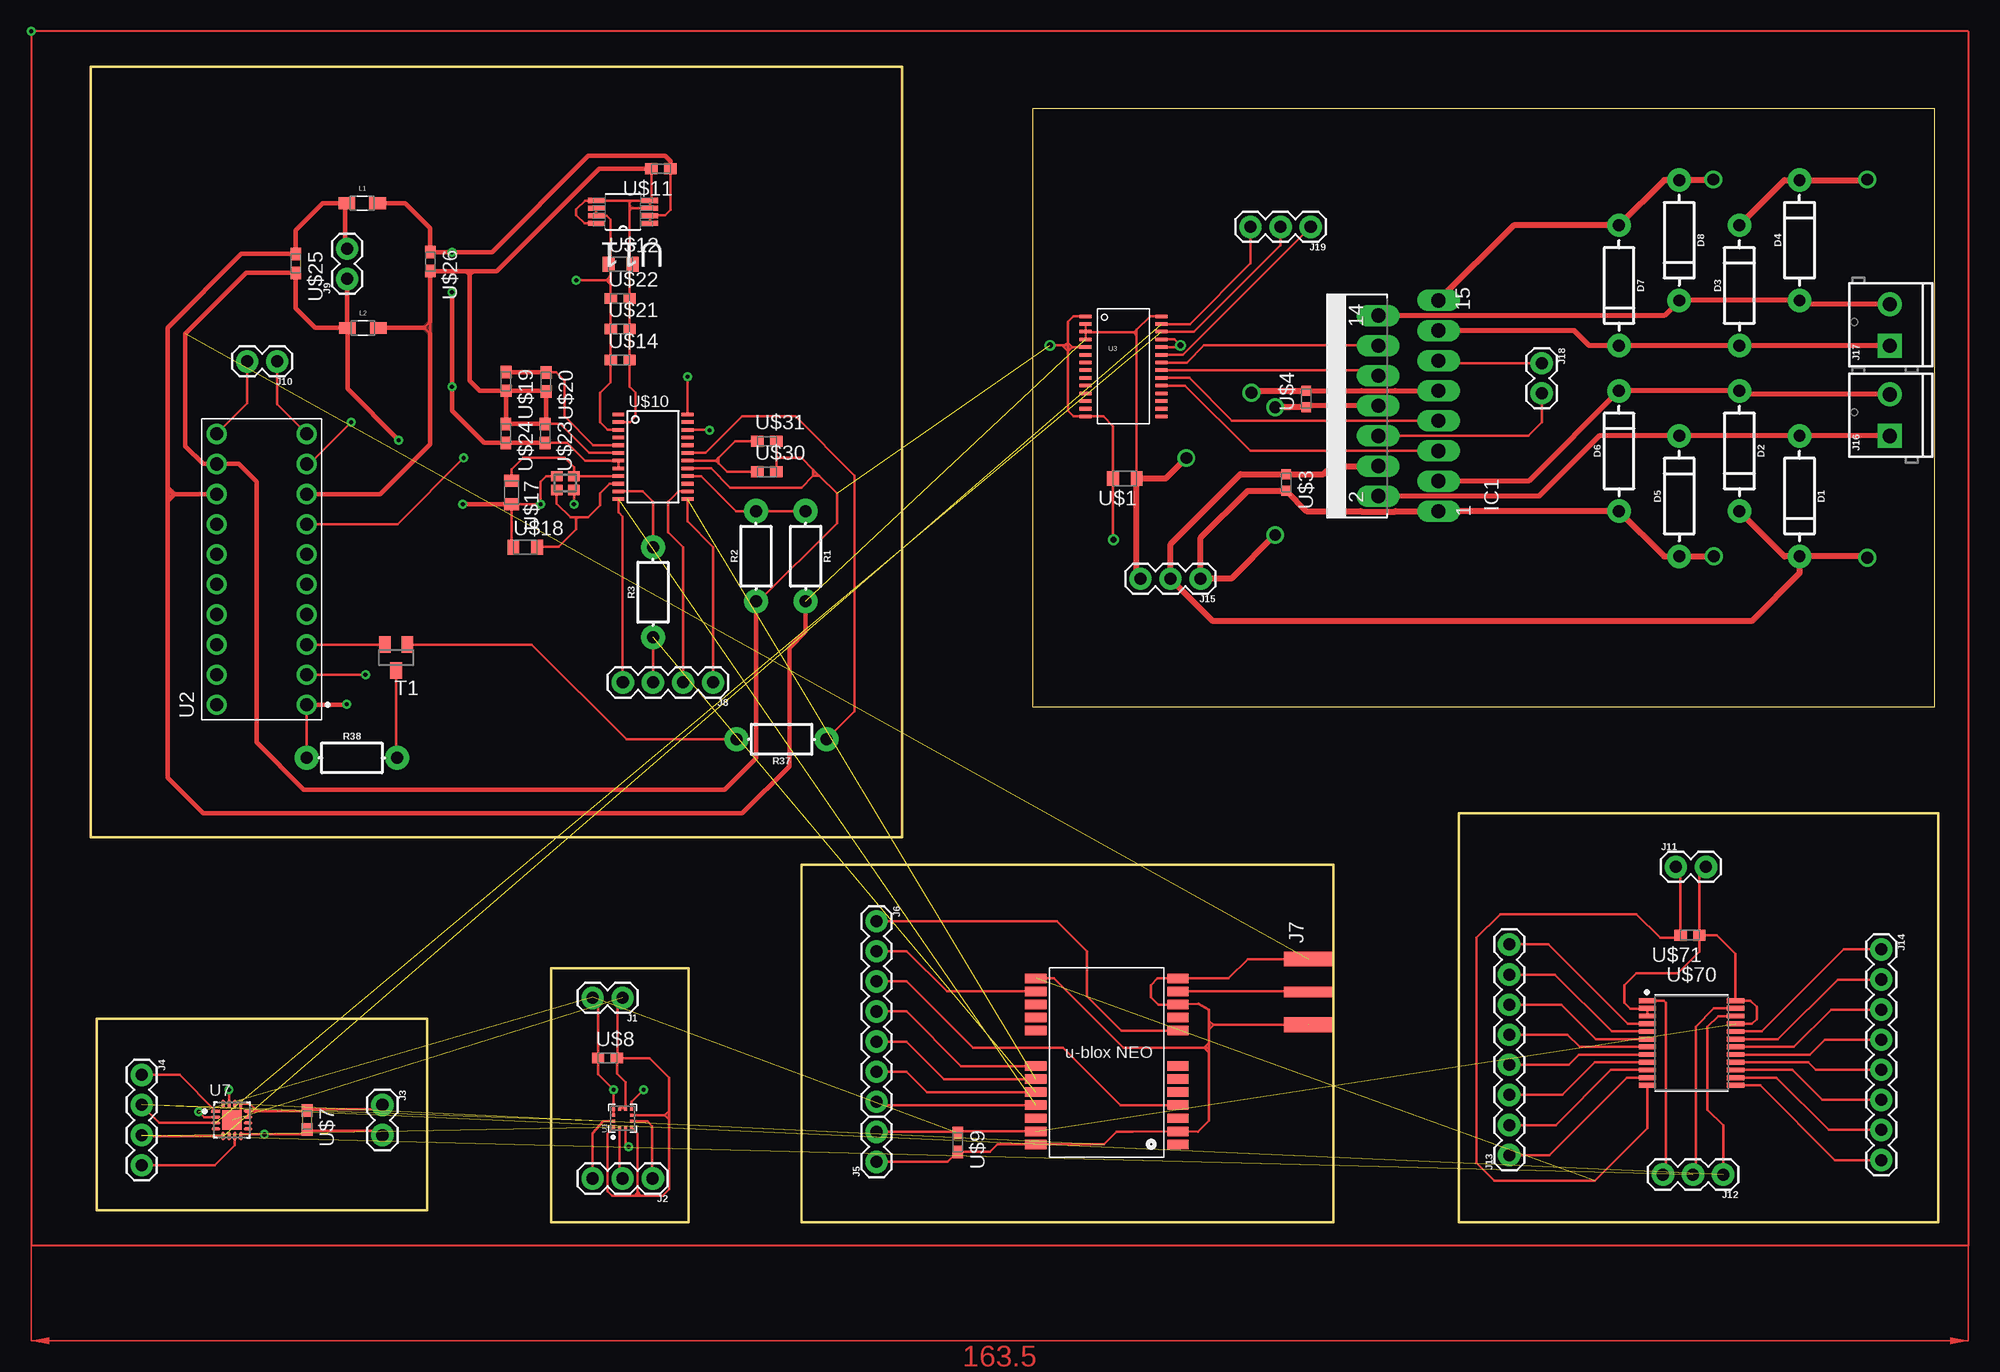
[diagram p6: board, top side]
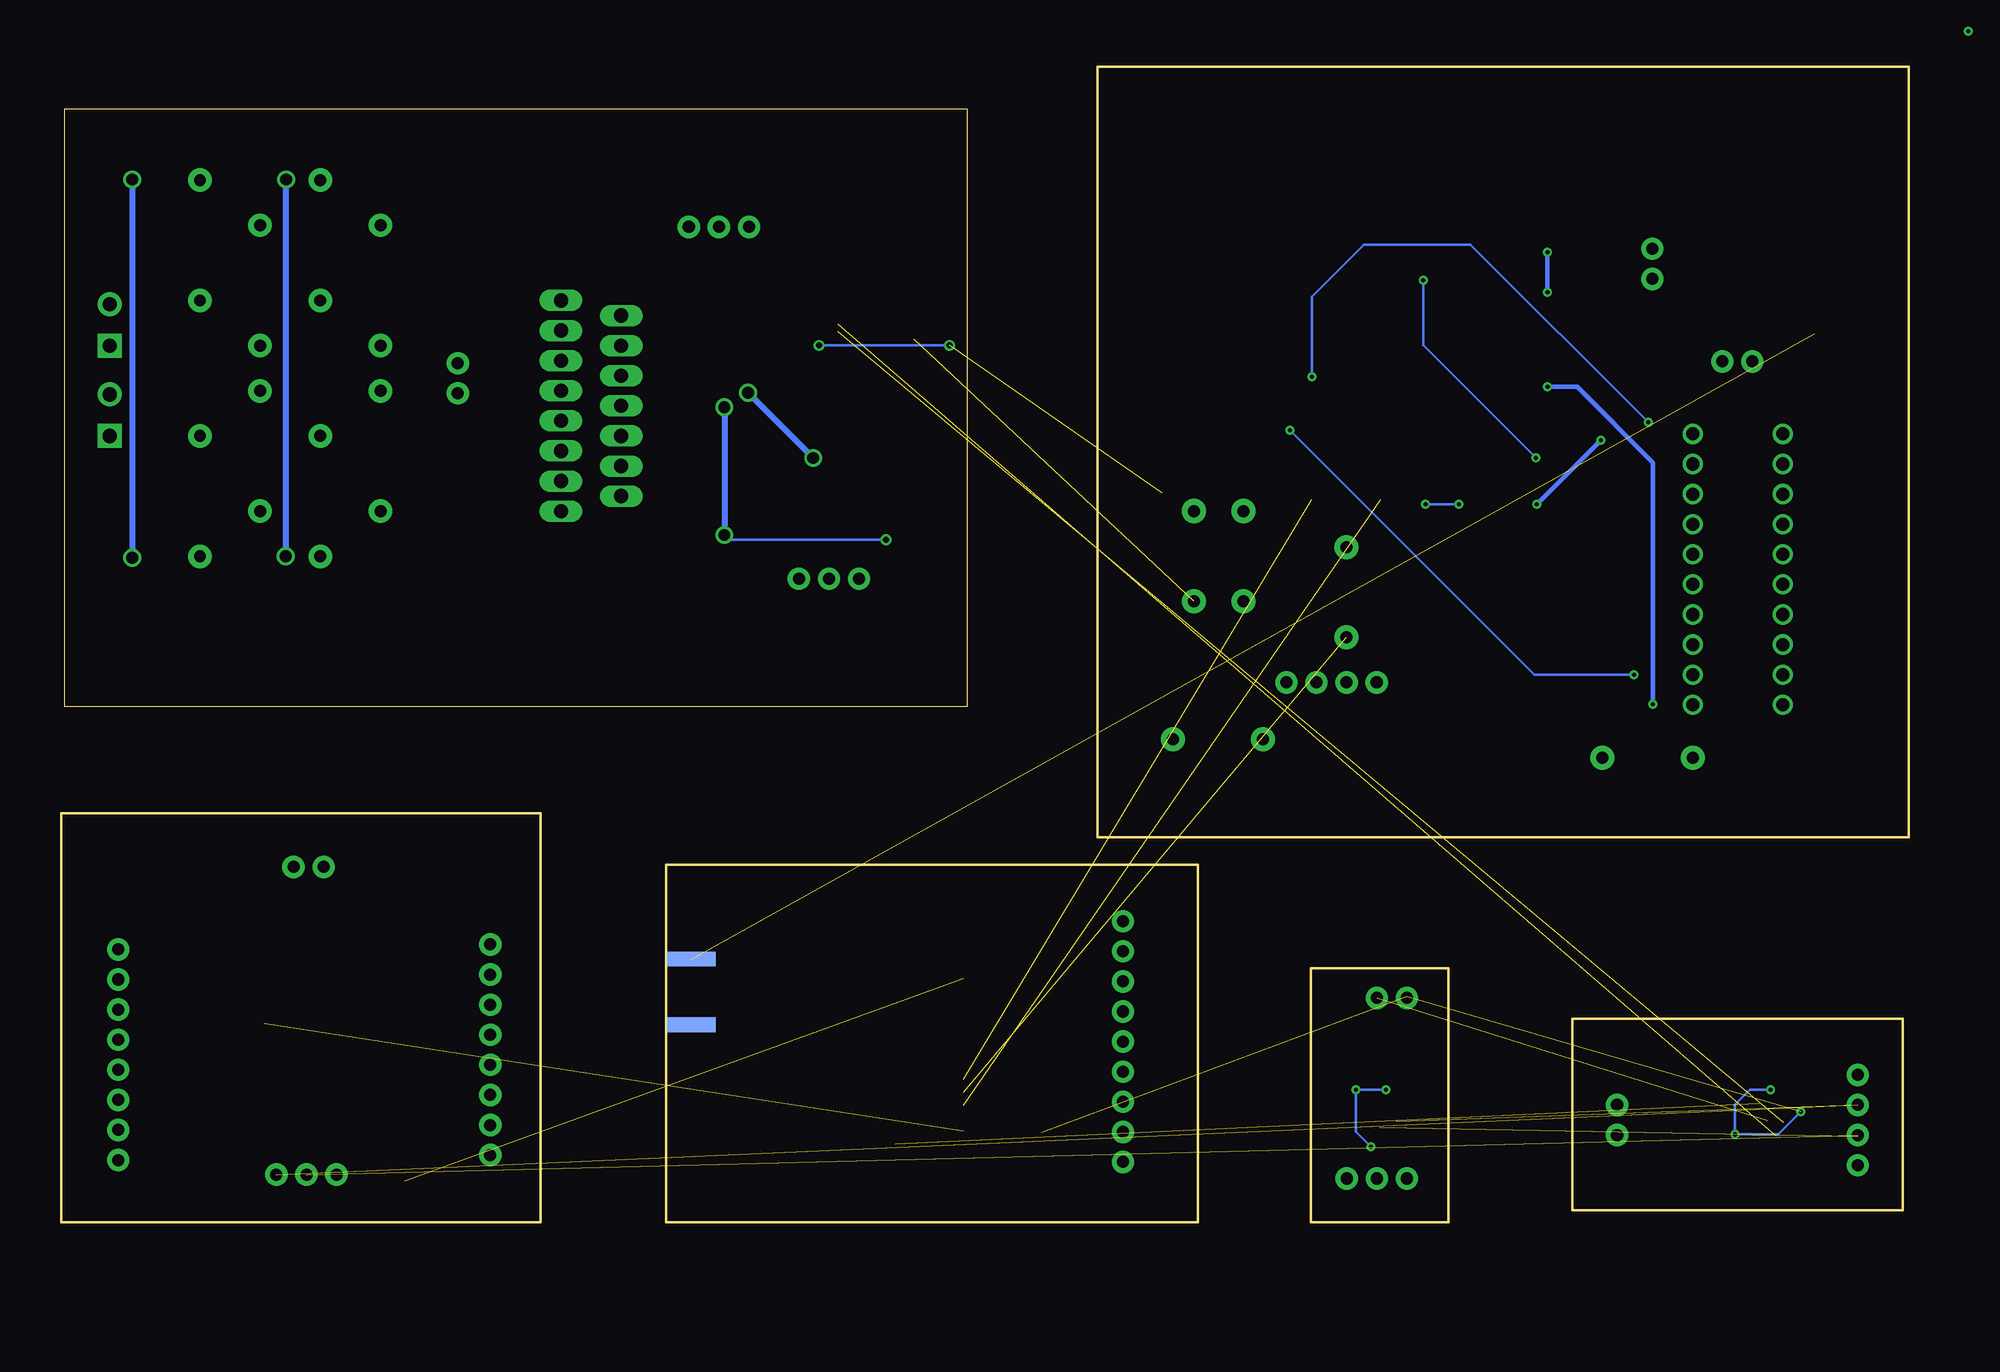
[diagram p7: board, bottom side, seen from below]

Size 156 x 97.5 mm. Coordinates in mm from the lower left corner, seen from the top.
Outline: 50.5,0 50.5,21.44 38.89,21.44 38.89,0 50.5,0
Outline: 0.5,1 28.42,1 28.42,17.18 0.5,17.18 0.5,1
Outline: 60,0 104.94,0 104.94,30.15 60,30.15 60,0
Outline: 0,32.5 68.5,32.5 68.5,97.5 0,97.5 0,32.5
Outline: 115.5,0 156,0 156,34.5 115.5,34.5 115.5,0
Outline: 79.5,43.5 155.68,43.5 155.68,93.97 79.5,93.97 79.5,43.5
Copper layers (1*16): Top 0.035mm / dielectric 1.5mm / Bottom 0.035mm
Design rules "default": minimum track width 6mil, minimum drill 0.35mm, track to track 6mil, track to pad 6mil, pad to pad 6mil, via to via 6mil, smd to smd 6mil, copper to edge 40mil, drill to drill 6mil, minimum pad ring 10mil, minimum via ring 8mil, stop-mask expansion 4mil, vias tented up to drill 0mil, thermal gap 10mil

### Footprints (pad centres in the part's own frame; a part is rotated, then mirrored left to right if it is on the bottom)
DIODE-1N4001 = drill 1 pad 1.981: A -5.08,0; C 5.08,0
MULTIWATT-15 = drill 1.2 long: 1 -8.89,-7.62; 2 -7.62,-2.54; 3 -6.35,-7.62; 4 -5.08,-2.54; 5 -3.81,-7.62; 6 -2.54,-2.54; 7 -1.27,-7.62; 8 0,-2.54; 9 1.27,-7.62; 10 2.54,-2.54; 11 3.81,-7.62; 12 5.08,-2.54; 13 6.35,-7.62; 14 7.62,-2.54; 15 8.89,-7.62
1X02 = drill 1.016 pad 1.88: 1 0,0; 2 2.54,0
1X03 = drill 1.016 pad 1.88: 1 0,0; 2 2.54,0; 3 5.08,0
1X04 = drill 1.016 pad 1.88: 1 0,0; 2 2.54,0; 3 5.08,0; 4 7.62,0
1X07 = drill 1.016 pad 1.88: 1 0,0; 2 2.54,0; 3 5.08,0; 4 7.62,0; 5 10.16,0; 6 12.7,0; 7 15.24,0
60312202114508 = smd 1.25 x 4.1: 1 -2.775,0; 3 2.775,0 | smd 0.9 x 4.1: 2 0,0 | smd 1.25 x 4.1 bottom: 4 -2.775,0; 5 2.775,0
1X08 = drill 1.016 pad 1.88: 1 0,0; 2 2.54,0; 3 5.08,0; 4 7.62,0; 5 10.16,0; 6 12.7,0; 7 15.24,0; 8 17.78,0
SCREWTERMINAL-3.5MM-2 = drill 1.2 pad 2.032 square: 1 0,0 | drill 1.2 pad 2.032: 2 3.5,0
WE-CBA_0805(W=4) = smd 1.4 x 1: 1 -1.3,0; 2 1.3,0
FA-128 = smd 0.95 x 0.85: 1 -0.725,-0.575; 2 0.725,-0.575; 3 0.725,0.575; 4 -0.725,0.575
AXIAL-0.3-KIT = drill 1.016 pad 2.032: P$1 -3.81,0; P$2 3.81,0
SOT23 = smd 1 x 1.4: 1 -0.95,-1.1; 2 0.95,-1.1; 3 0,1.1
KIONIX_KXTJ3-1057 = smd 0.275 x 0.25: 1 -0.762,0.75; 2 -0.762,0.25; 3 -0.762,-0.25; 4 -0.762,-0.75; 7 0.762,-0.75; 8 0.762,-0.25; 9 0.762,0.25; 10 0.762,0.75 | smd 0.25 x 0.275: 5 -0.25,-0.762; 6 0.25,-0.762; 11 0.25,0.762; 12 -0.25,0.762
HDRVR20W64P762X254_2X10_2540X1016X254B = drill 1.105 pad 1.705: 1 0,0; 2 2.54,0; 3 5.08,0; 4 7.62,0; 5 10.16,0; 6 12.7,0; 7 15.24,0; 8 17.78,0; 9 20.32,0; 10 22.86,0; 11 22.86,7.62; 12 20.32,7.62; 13 17.78,7.62; 14 15.24,7.62; 15 12.7,7.62; 16 10.16,7.62; 17 7.62,7.62; 18 5.08,7.62; 19 2.54,7.62; 20 0,7.62
TSSOP-28_4MM = smd 1 x 0.3: 1 -3.2,4.225; 2 -3.2,3.575; 3 -3.2,2.925; 4 -3.2,2.275; 5 -3.2,1.625; 6 -3.2,0.975; 7 -3.2,0.325; 8 -3.2,-0.325; 9 -3.2,-0.975; 10 -3.2,-1.625; 11 -3.2,-2.275; 12 -3.2,-2.925; 13 -3.2,-3.575; 14 -3.2,-4.225; 15 3.2,-4.225; 16 3.2,-3.575; 17 3.2,-2.925; 18 3.2,-2.275; 19 3.2,-1.625; 20 3.2,-0.975; 21 3.2,-0.325; 22 3.2,0.325; 23 3.2,0.975; 24 3.2,1.625; 25 3.2,2.275; 26 3.2,2.925; 27 3.2,3.575; 28 3.2,4.225
MELEXIS_TECHNOLOGIES_MLX90393SLW-ABA-011-RE_0 = smd 0.74 x 0.239: 1 -1.366,0.75; 2 -1.366,0.25; 3 -1.366,-0.25; 4 -1.366,-0.75; 9 1.366,-0.75; 10 1.366,-0.25; 11 1.366,0.25; 12 1.366,0.75 | smd 0.239 x 0.74: 5 -0.75,-1.366; 6 -0.25,-1.366; 7 0.25,-1.366; 8 0.75,-1.366; 13 0.75,1.365; 14 0.25,1.365; 15 -0.25,1.365; 16 -0.75,1.365 | smd 1.675 x 1.675: 17 0,0
SOP65P490X110-8N = smd 1.397 x 0.432: 1 -2.261,0.965; 2 -2.261,0.33; 3 -2.261,-0.33; 4 -2.261,-0.965; 5 2.261,-0.965; 6 2.261,-0.33; 7 2.261,0.33; 8 2.261,0.965
RESC0805_L = smd 1 x 1.25: 1 -1,0; 2 1,0
RESC0603_L = smd 0.85 x 0.8: 1 -0.7,0; 2 0.7,0
NEO-M8 = smd 1.8 x 0.8: 1 6.4,-7.4; 2 6.4,-6.3; 3 6.4,-5.2; 4 6.4,-4.1; 5 6.4,-3; 6 6.4,-1.9; 7 6.4,-0.8; 8 6.4,2.2; 9 6.4,3.3; 10 6.4,4.4; 11 6.4,5.5; 12 6.4,6.6; 13 -5.6,6.6; 14 -5.6,5.5; 15 -5.6,4.4; 16 -5.6,3.3; 17 -5.6,2.2; 18 -5.6,-0.8; 19 -5.6,-1.9; 20 -5.6,-3; 21 -5.6,-4.1; 22 -5.6,-5.2; 23 -5.6,-6.3; 24 -5.6,-7.4
RESC0603_N = smd 1.05 x 0.9: 1 -0.8,0; 2 0.8,0
TSSOP24 = smd 0.305 x 0.991: 1 -3.575,-2.918; 2 -2.925,-2.918; 3 -2.275,-2.918; 4 -1.625,-2.918; 5 -0.975,-2.918; 6 -0.325,-2.918; 7 0.325,-2.918; 8 0.975,-2.918; 9 1.625,-2.918; 10 2.275,-2.918; 11 2.925,-2.918; 12 3.575,-2.918; 13 3.575,2.918; 14 2.925,2.918; 15 2.275,2.918; 16 1.625,2.918; 17 0.975,2.918; 18 0.325,2.918; 19 -0.325,2.918; 20 -0.975,2.918; 21 -1.625,2.918; 22 -2.275,2.918; 23 -2.925,2.918; 24 -3.575,2.918
SOP65P810X120-24 = smd 1.469 x 0.402: 1 -3.721,3.575; 2 -3.721,2.925; 3 -3.721,2.275; 4 -3.721,1.625; 5 -3.721,0.975; 6 -3.721,0.325; 7 -3.721,-0.325; 8 -3.721,-0.975; 9 -3.721,-1.625; 10 -3.721,-2.275; 11 -3.721,-2.925; 12 -3.721,-3.575; 13 3.721,-3.575; 14 3.721,-2.925; 15 3.721,-2.275; 16 3.721,-1.625; 17 3.721,-0.975; 18 3.721,-0.325; 19 3.721,0.325; 20 3.721,0.975; 21 3.721,1.625; 22 3.721,2.275; 23 3.721,2.925; 24 3.721,3.575

### Placement (x,y rotation side)
D1  144.27,61.28 270 top
D2  139.19,65.09 270 top
D3  139.19,79.06 90 top
D4  144.27,82.87 90 top
D5  134.11,61.28 90 top
D6  129.03,65.09 90 top
D7  129.03,79.06 270 top
D8  134.11,82.87 270 top
IC1  106.17,68.9 90 top
J1  44.91,18.92 180 top
J2  47.45,3.68 180 top
J3  24.63,9.89 270 top
J4  4.31,12.43 270 top
J5  66.35,5.08 90 top
J6  66.35,25.4 270 top
J7  102.8,19.43 90 top
J8  52.55,45.55 180 top
J9  21.66,79.62 90 top
J10  15.75,72.65 180 top
J11  133.83,29.98 0 top
J12  137.82,4.02 180 top
J13  119.76,5.66 90 top
J14  151.17,23.02 270 top
J15  93.71,54.31 180 top
J16  151.89,66.36 90 top
J17  151.89,73.98 90 top
J18  122.5,72.5 270 top
J19  103,84 180 top
L1  22.93,86 0 top
L2  22.98,75.47 0 top
Q3  40.08,62.37 180 top
R1  60.36,56.21 270 top
R2  56.17,56.21 90 top
R3  47.47,53.17 90 top
R37  58.33,40.76 180 top
R38  22.06,39.18 0 top
T1  25.8,47.66 180 top
U1  44.91,8.76 90 top
U2  18.25,43.67 90 top
U3  87.19,72.23 0 top
U7  11.93,8.62 0 top
U11  44.95,85.26 180 top
U$1  87.31,62.77 180 top
U$3  100.94,62.43 270 top
U$4  102.6,69.49 90 top
U$6  85.4,13.97 0 top
U$7  18.28,8.62 270 top
U$8  43.64,13.84 0 top
U$9  73.21,6.73 270 top
U$10  47.47,64.6 270 top
U$11  48.14,88.91 180 top
U$12  44.74,80.86 0 top
U$14  44.7,72.76 0 top
U$17  35.55,61.58 270 top
U$18  36.69,56.97 0 top
U$19  35.07,70.97 270 top
U$20  38.45,70.92 270 top
U$21  44.7,75.38 0 top
U$22  44.7,77.96 0 top
U$23  38.37,66.58 270 top
U$24  35.06,66.58 270 top
U$25  17.32,80.92 270 top
U$26  28.67,81.08 270 top
U$30  57.09,63.33 0 top
U$31  57.09,65.91 0 top
U$70  135.14,15.12 0 top
U$71  135.01,24.22 180 top

### Tracks (layer width: path | path; a pad name or v marks a point on that pad's centre or on a via)
0  (via drill 0.35, 0.5, 1)  (7 unrouted)
  Top 0.2: U1.9 44.66,9.63 45.11,9.63 U1.8 45.16,11.82 44.44,12.54 U$8.2 | 44.66,13.71 U$8.2 | 45.72,9.02 U1.6 | 45.72,7.95 U1.4 46.18,7.48 46.18,2.54 | U$8.2 44.51,13.89 44.51,18.57 44.81,18.87 J1.1 | U$8.2 45.42,13.84 | U1.6 46.81,9.01 | U$8.2 47.2,13.84 48.85,12.19 48.85,9.39 | 46.18,2.54 45.88,2.23 | 45.88,2.23 44.02,2.23 43.64,2.62 43.64,7.48 U1.1 | 46.18,2.54 46.25,2.48 | 46.25,2.48 46.31,2.41 | 46.31,2.41 46.49,2.23 | 46.49,2.23 48.29,2.23 48.85,2.79 48.85,8.64 | 46.13,2.23 46.49,2.23 | 45.88,2.23 46,2.23 | 46,2.23 46.25,2.48 | 46,2.23 46.13,2.23 | 46.13,2.23 46.31,2.41 | U1.6 48.47,9.01 | 48.47,9.01 48.85,8.64 | 48.85,8.64 48.85,9.39 | 48.47,9.01 48.85,9.39 | 18.33,9.53 24.27,9.53 J3.1 | 18.33,9.53 U$7.1 | 12.18,8.87 U7.17 12.68,9.37 U7.13 13.45,9.98 13.77,9.67 | U7.11 U7.12 13.64,9.37 | 13.64,9.37 14,9.37 | 14,9.37 18.17,9.37 18.33,9.53 | 14,9.37 14,9.43 13.77,9.67 | 13.77,9.67 13.77,9.49 13.64,9.37 | U$6.13 81.34,20.57 87.18,14.73 94,14.73 | 94,14.73 94.29,14.73 | 88,7.62 U$6.2 93.5,7.65 94.42,8.56 94.42,14.32 | 88,7.62 87.94,7.62 | J5.1 72.36,5.08 U$9.2 75.93,5.93 76.57,6.57 U$6.24 85.57,6.57 86.62,7.62 88,7.62 | 94.42,17.02 94.42,17.91 93.53,18.41 U$6.10 90.13,18.37 89.5,19 89.5,20 90.07,20.57 U$6.12 96.07,20.57 97.71,22.21 J7.5 | 94.42,17.02 94.42,16.26 | 94.42,16.26 94.42,15.15 | 94.42,15.15 94.42,14.32 | 94,14.73 94.42,15.15 | 94,14.73 94.42,14.32 | J7.4 94.82,16.66 | 94.82,16.66 94.42,16.26 | 94.82,16.66 94.78,16.66 94.42,17.02 | U$30.2 57.89,64.5 | 57.89,64.5 U$31.2 | 57.89,64.5 60,64.5 61,63.5 | 61,63.5 61.5,63 | 61.5,63 63,61.5 63,59 56.4,52.4 R2.P$1 | U$10.17 52.38,63.62 54,62 60,62 61,63 | 61,63 61.5,63 | 61,63 61,63.5 | U$18.1 35.55,57.11 U$17.2 37.98,60.58 v38,60.6 38,62.5 38.44,62.95 Q3.2
  Top 0.2: 21.66,75.49 L2.1 | v40.8,60.6 v40.81,60.61 Q3.4 | 12.5,64 12.49,63.99 | J11.1 134.21,29.6 U$71.2 133.99,24 132.5,24 130.5,26 119,26 117,24 117,5 118.5,3.5 127,3.5 131.42,7.92 U$70.12 | 82.5,73.5 82.5,68.5 83,68 U3.14 85.5,68 86.31,67.19 U$1.2 86.31,57.64 v86.36,57.6 | U3.1 82.96,76.45 82.5,76 82.5,74.23 | U3.5 82.88,73.86 | 82.88,73.86 82.85,73.86 82.5,73.5 | 82.88,73.86 82.5,74.23 | U3.25 91.5,74.5 v92,74 91.85,73.86 U3.24 | 82.5,74.23 82.5,73.5 | v81,74 82,74 | 82,74 82.5,73.5 | 82,74 82.27,74 82.5,74.23
  Top 0.4: J9.1 21.66,75.49 | U$17.2 v31.42,60.58 | v26,66 21.68,70.32 L2.1 18.97,75.47 17.32,77.12 U$25.2 13.12,80.12 8,75 8,65.5 9.51,63.99 U2.12 12.49,63.99 | R2.P$1 56.17,39.17 53.5,36.5 18,36.5 14,40.5 14,62.5 12.5,64
  Top 0.406: IC1.8 102.71,68.9 U$4.1
  Top 0.508: v137.03,56.2 D5.A 132.84,56.2 D6.A IC1.1 110.19,60.01 110.15,59.97 107.27,59.97 107.23,60.01 102.66,60.01 U$3.2 97.69,61.73 93.71,57.75 J15.1 96.31,54.31 v100,58 | v137,88 136.95,87.95 D8.A 132.84,87.95 D7.A | D7.A 128.87,84.31 | D7.A 120.14,84.14 IC1.15 | U$4.1 100.02,68.79 v100,68.77
  Bottom 0.2: J3.1 24.12,9.38 | v38,60.6 v40.8,60.6 | v92,74 v81,74 | v86.36,57.6 99.6,57.6 v100,58
  Bottom 0.4: v26,66 v31.42,60.58
  Bottom 0.508: v137.03,56.2 137,56.23 v137,88 | v100,68.77 v100,58
  pour Top: 48.5,9 48.74,8.76 48.85,8.76 48.85,9.14 48.59,9.14 48.47,9.02 arc90 48.48,9
  pour Top: 94.04,14.73 94.42,15.11 94.42,14.35
  pour Top: 94.42,17.02 94.8,16.64 94.42,16.26
  pour Top: 57.9,64.65 58.05,64.5 57.9,64.35
  pour Top: 61,63 61,63.5 61.5,63
  pour Top: 82.55,74.23 82.93,73.85 82.55,73.47
  pour Top: 82,74 82.5,73.5 82.5,74
3.3V  (via drill 0.35)  (3 unrouted)
  Top 0.152: U1.11 arc90 44.16,9.03
  Top 0.2: 42.37,19.02 J1.2 42.37,18.87 42.83,18.41 42.83,13.89 U$8.1 42.84,12.5 44.16,11.18 | 44.16,11.18 U1.10 44.16,9.03 arc-90 U1.11 | 44.16,11.18 v44.15,11.18 | U1.7 45.66,10.15 v46.69,11.18 | v45.42,6.35 45.16,6.61 U1.3 | U7.8 12.69,7.4 v14.67,7.4 17.87,7.4 18.18,7.71 U$7.2 18.33,7.71 24.27,7.71 J3.2 | U7.2 9.57,8.87 v9.11,9.33 | U7.15 v11.68,11.18 | J5.2 73.12,7.62 U$9.1 73.35,7.67 U$6.23 | J11.2 135.81,29.42 U$71.1 | U$71.1 137.28,24.22 138.86,22.64 U$70.24 140.11,18.7 140.65,18.16 140.65,17.14 140.25,16.75 U$70.21 | U$70.3 131.42,18 | 131.42,18 U$70.2 | U$71.1 135.81,22.81 134,21 130.5,21 129.5,20 129.5,18.5 130,18 131.42,18
  Bottom 0.2: v44.15,11.18 v46.69,11.18 46.69,7.62 v45.42,6.35 | v9.11,9.33 11.04,7.4 v14.67,7.4 14.69,7.41 14.69,9.93 13.43,11.18 v11.68,11.18
5V  (via drill 1)  (1 unrouted)
  Top 0.152: U3.2 U3.3 U3.4
  Top 0.2: L1.1 21.5,86 | J9.2 21.5,82.31 | U3.28 89.46,76.45 88.31,75.31 | 88.31,75.31 88.31,74.87 | 88.31,74.87 U$1.1 | 88.31,75.31 88.09,75.09 | 88.09,75.09 88.31,74.87 | 88.09,75.09 85.38,75.09 85.34,75.12 84.02,75.12 U3.3
  Top 0.4: 21.5,82.31 21.5,86 19.59,86 17.32,83.72 U$25.1 12.72,81.72 6.5,75.5 6.5,62 | R1.P$2 60.36,49.86 59,48.5 59,38.5 55,34.5 9.5,34.5 6.5,37.5 6.5,60.9 | 6.5,60.9 6.5,62 | 7.05,61.45 6.5,62 | U2.13 7.05,61.45 | 7.05,61.45 6.5,60.9
  Top 0.406: IC1.9 113.77,70.19 110.14,70.19 110.13,70.18 107.29,70.18 107.28,70.19 U$4.2
  Top 0.508: J15.3 88.31,54.63 U$1.1 90.77,62.77 v92.5,64.5 | v98,70 98.19,70.19 U$4.2
  Bottom 0.508: v92.5,64.5 v98,70
  pour Top: 6.5,62 7,61.5 6.5,61
12V  (via drill 1)
  Top 0.406: 149.95,87.95 v150,88
  Top 0.508: D3.C 143,87.95 D4.C 149.95,87.95 | v149.99,56.07 149.86,56.2 D1.C | D1.C 143,56.2 D2.C | IC1.4 104.78,63.82 104.09,63.13 U$3.1 97.09,63.13 91.17,57.21 J15.2 94.75,50.73 140.23,50.73 144.27,54.77 D1.C
  Bottom 0.406: 150,56.09 v149.99,56.07
  Bottom 0.508: v150,88 150,56.09
ACC-INT
  Top 0.2: J2.1 47.4,3.73 47.4,8.1 47,8.5 45.69,8.5 arc-90 U1.5
CE0
  Top 0.2: U$6.18 73.5,13.17 68.89,17.78 J6.4
CLK  (1 unrouted)
  Top 0.2: U$6.19 72.06,12.07 68.89,15.24 J6.5 | U$10.13 50.39,59.14 52.55,56.98 J8.1
COMP-INT
  Top 0.2: 10.56,9.38 U7.1 7.5,12.43 J4.1
COMP-INT-TRIG
  Top 0.2: U7.7 12.18,6.51 10.48,4.81 J4.4
CS
  Top 0.2: U$10.14 49.62,61.67 48.74,60.79 48.74,58.25 50.01,56.98 J8.2
GND
  Top 0.2: U$10.6 42.08,64.92 39.62,67.38 U$23.1 38.45,67.46 | U$19.2 | 38.4,70.17 U$20.2 | U$10.2 45.53,67.53 46,68 46,70 45.5,70.5 U$14.2 U$21.2 U$22.2 45.5,80.62 U$12.2 45.74,81.13 45.5,81.38 45.5,85.52 45.58,85.59 | U11.4 47.21,86 | 47.21,86 U11.3 45.58,85.59 | U11.4 45.5,86.22 | 45.5,86.22 U11.5 41.72,86.22 41,85.5 41,85 41.7,84.3 U11.8 | 45.5,86.22 45.5,85.6 45.51,85.59 45.58,85.59 | 47.37,86.16 47.21,86 | U$11.2 47.34,86.35 U11.4 | L2.2 24.31,75.5 | 32,80 32,80.28 | 32.28,80.28 32.3,80.28 | 28.67,75 28.67,76 28.17,75.5 28.67,75
  Top 0.4: U$23.1 U$24.1 U$19.2 | 38.4,70.17 U$19.2 32.83,70.17 32,71 32,80 | U$20.2 38.45,67.46 | 28.67,76 U$26.2 31.72,80.28 | 31.72,80.28 32,80.28 32.28,80.28 32,80 | 32.3,80.28 34.28,80.28 42.91,88.91 U$11.2 | U2.8 24.45,61.45 28.67,65.67 28.67,75 | 24.31,75.5 28.17,75.5 | 31.72,80.28 32,80
  pour Top: 45.75,85.6 45.5,85.85 45.5,85.35
  pour Top: 45.72,86.22 45.5,86 45.28,86.22
  pour Top: 28.15,75.5 28.65,76 28.65,75
GPS-INT
  Top 0.2: U$6.4 86.96,9.87 82.1,14.73 74.48,14.73 68.89,20.32 J6.3
GPS-LNA
  Top 0.2: U$6.14 72.28,19.47 68.89,22.86 J6.2
GPS-RESET
  Top 0.2: U$6.8 87.01,16.17 84.13,19.05 84.13,22.86 81.59,25.4 J6.1
IO-INT
  Top 0.2: U$70.1 132.81,18.7 133,18.5 133,4.28 J12.3
MISO  (1 unrouted)
  Top 0.2: U$6.20 70.62,10.97 68.89,12.7 J6.6 | R3.P$1 J8.3
MOSI  (1 unrouted)
  Top 0.2: U$6.21 66.64,9.87 J6.7 | U$10.12 44.55,59.9 44.93,59.52 J8.4
MOTOR-EN1
  Top 0.2: J18.2 122.5,67.5 121.36,66.36 IC1.6
MOTOR-EN2
  Top 0.2: J18.1 114,72.5 IC1.11
N$1
  Top 0.2: U2.10 15.75,69.03 J10.1
N$2
  Top 0.2: Q3.3 39.36,60.64 40.5,59.5 41,59.5 | 41,59.5 42,59.5 43,60.5 43,61.5 43.83,62.33 U$10.10 | U$18.2 37.72,57 39.5,57 41,58.5 41,59.5
  pour Top: 41.2,59.5 41,59.3 40.8,59.5
N$3
  Top 0.2: U$70.4 129.75,16.75 123.06,23.44 J13.8
N$4
  Top 0.2: U$70.5 128.41,16.09 123.6,20.9 J13.7
N$5
  Top 0.2: U$70.6 127.06,15.45 124.14,18.36 J13.6
N$6
  Top 0.2: U$70.7 125.71,14.8 124.68,15.82 J13.5
N$7
  Top 0.2: U$70.8 125.65,14.14 124.78,13.28 J13.4
N$8
  Top 0.2: U$70.9 127,13.5 124.24,10.74 J13.3
N$9
  Top 0.2: U$70.10 128.34,12.84 123.7,8.2 J13.2
N$10
  Top 0.2: U$70.11 129.69,12.2 123.16,5.66 J13.1
N$11
  Top 0.2: U$70.13 140.96,11.55 147.26,5.24 J14.8
N$12
  Top 0.2: U$70.14 142.31,12.2 146.72,7.78 J14.7
N$13
  Top 0.2: U$70.15 143.66,12.84 146.18,10.32 J14.6
N$14
  Top 0.2: U$70.16 145,13.5 145.64,12.86 J14.5
N$15
  Top 0.2: U$70.17 145.15,14.14 146.4,15.4 J14.4
N$16
  Top 0.2: U$70.18 143.79,14.8 146.94,17.94 J14.3
N$17
  Top 0.2: U$70.19 142.44,15.45 147.48,20.48 J14.2
N$18
  Top 0.2: U$70.20 141.09,16.09 148.02,23.02 J14.1
N$19
  Top 0.2: IC1.5 97.91,65.09 92.4,70.61 U3.19
N$20
  Top 0.2: IC1.7 96.37,67.63 92.75,71.25 U3.20
N$21
  Top 0.2: U3.21 108.25,71.91 IC1.10
N$22
  Top 0.2: U3.22 92.56,72.56 94,74 108.69,74 IC1.12
N$23  (via drill 0.35)
  Top 0.152: v-5,100.5 -5,-2 158.5,-2 158.5,100.5 v-5,100.5
N$31
  Top 0.406: J16.1 D1.A D5.C 127.36,66.36 122.28,61.28 IC1.2
N$32
  Top 0.406: J16.2 139.5,69.86 D2.A D6.C 121.41,62.55 IC1.3
N$33
  Top 0.406: J17.1 D3.A D7.C 126.52,73.98 125.25,75.25 IC1.13
N$34
  Top 0.2: D8.C 133.91,77.59
  Top 0.406: J17.2 144.58,77.48 D4.A D8.C | 133.91,77.59 132.84,76.52 IC1.14
N$39
  Top 0.2: U$6.11 102.76,19.47 J7.2
N$40
  Top 0.2: U$10.9 40.83,62.98 Q3.1 40.81,63.7 40,64.5 36.5,64.5 35.55,63.55 U$17.1
N$42
  Top 0.2: U2.11 13.21,69.11 J10.2
N$43
  Top 0.2: T1.3 25.8,39.26 R38.P$2
N$45
  Top 0.2: 35.12,71.72 U$19.1 | U$20.1 39.28,71.72 40,71 40,68 42.42,65.58 U$10.5
  Top 0.4: U$20.1 35.12,71.72
N$46
  Top 0.2: R37.P$2 45.25,40.76 37.25,48.76 T1.1
N$48  (via drill 0.35)
  Top 0.2: U$10.3 43.62,66.88 43,67.5 43,70 43.9,70.9 U$14.1 U$21.1 U$22.1 43.9,79.1 | U11.6 U11.7 43.57,84.93 43.9,84.6 43.9,81.02 U$12.1 43.9,80.7 43.9,79.9 | 43.9,79.1 43.9,79.5 | U2.7 25.91,58.91 v31.5,64.5 | v41,79.5 43.5,79.5 | 43.5,79.5 43.9,79.5 | 43.9,79.5 43.9,79.9 | 43.5,79.5 43.9,79.9 | 43.5,79.5 43.9,79.1
  Bottom 0.2: v31.5,64.5 41,74 v41,79.5
  pour Top: 43.5,79.5 43.9,79.9 43.9,79.1
N$50
  Top 0.2: U$10.16 51.53,62.98 54.48,60.02 R1.P$1 R2.P$2
N$51
  Top 0.2: U$10.18 52.78,64.28 | U$31.1 54.41,65.91 53,64.5 | 52.78,64.28 52.93,64.43 | U$30.1 53.72,63.33 53,64.05 | 53,64.05 52.83,64.22 | 53,64.5 53,64.22 | 53,64.22 53,64.05 | 52.78,64.28 52.83,64.22 | 52.83,64.22 52.93,64.22 | 52.93,64.22 53,64.22 | 53,64.5 52.93,64.43 | 52.93,64.43 52.93,64.22
N$53
  Top 0.2: T1.2 U2.3
N$58  (via drill 0.35)
  Top 0.2: U2.2 v23.19,46.21 v23.2,46.2 | v52.25,66.85 52.22,66.88 U$10.22
  Bottom 0.2: v23.2,46.2 31.6,46.2 v52.25,66.85
N$59  (via drill 0.35)
  Top 0.2: 18.49,63.99 v22,67.5 | v50.4,71.35 U$10.24
  Top 0.4: U2.9 18.49,63.99
  Bottom 0.2: v22,67.5 37,82.5 46,82.5 50.4,78.1 v50.4,71.35
N$66
  Top 0.2: R37.P$1 64.5,43.12 64.5,63 59.5,68 55,68 51.92,64.92 U$10.19
PWM_EN
  Top 0.2: U3.23 92.21,73.2 J19.1
SCL  (3 unrouted)
  Top 0.2: U1.12 43.26,8.51 42.37,7.49 J2.3 | J4.2 4.31,9.84 5.78,8.37 U7.3 | U$70.22 137.4,17.39 136.5,16.5 136.5,9.5 137.82,8.18 J12.1 | U3.26 93.16,75.16 100.46,82.46 J19.2
SDA  (3 unrouted)
  Top 0.2: U1.2 44.66,7.95 44.66,3.89 44.81,3.73 J2.2 | U7.5 11.17,7.25 4.31,7.25 J4.3 | U$70.23 137.04,18.05 135.5,16.5 135.5,4.24 J12.2 | U3.27 92.81,75.81 97.92,80.92 J19.3
SDF
  Top 0.2: U$10.11 46.58,61.67 47.47,60.79 R3.P$2
VCCA  (via drill 0.35)
  Top 0.2: U$10.8 U$10.7 41.72,64.28 40.22,65.78 U$23.2 | U11.1 U11.2 47.28,85 48.5,85 48.94,85.44 U$11.1 | U2.1 R38.P$1 | 21.57,43.67 v21.6,43.7
  Top 0.4: U$23.2 U$24.2 33.22,65.78 30.5,68.5 v30.5,70.5 v30.5,78.5 | L1.2 26.55,86 28.67,83.88 U$26.1 v30.5,81.88 33.88,81.88 42,90 48.5,90 48.94,89.56 U$11.1 | U2.1 21.57,43.67
  Bottom 0.4: v30.5,78.5 v30.5,81.88 | v21.6,43.7 21.6,64.1 28,70.5 v30.5,70.5
(copper drawn outside any net)
  shapes: Top area x1